# Altium project ATLAS(SAM9X75D).PrjPcb
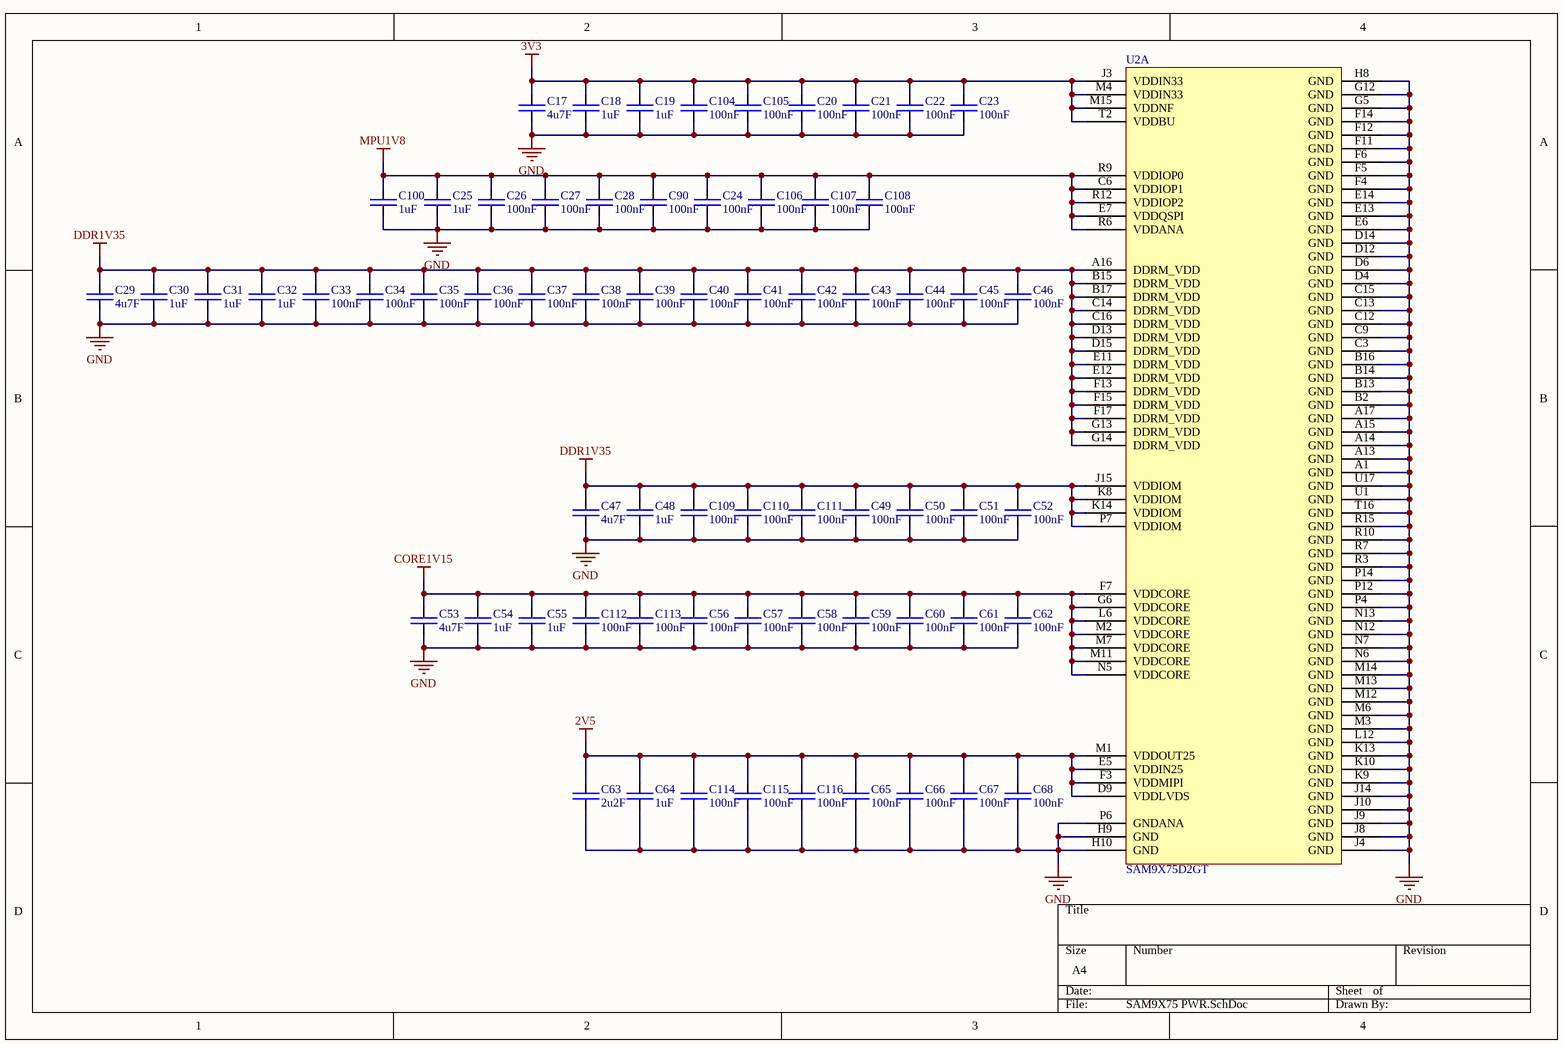
[diagram p0: SAM9X75 PWR.SchDoc]
10 sheets, 179 parts. Net scope: global (net labels, ports and power ports of the same name join across sheets).
Board file: PCB.PcbDoc
Sheets:
  SAM9X75 PWR.SchDoc
  SAM9X75 Pinout.SchDoc
  PMIC.SchDoc
  Ethernet.SchDoc
  SMARC Pinout-1.SchDoc
  SMARC Pinout-2.SchDoc
  SMARC Pinout-3.SchDoc
  Flash.SchDoc
  Level Shifting.SchDoc
  LDO.SchDoc

## Sheet SAM9X75 PWR.SchDoc
size A4; SheetNumber: 1; SheetTotal: 10

### Parts
C17  4u7F  [CAP-0805]
C18  1uF  [CAP-0805]
C19  1uF  [CAP-0805]
C20  100nF  [CAP-0201]
C21  100nF  [CAP-0201]
C22  100nF  [CAP-0201]
C23  100nF  [CAP-0201]
C24  100nF  [CAP-0201]
C25  1uF  [CAP-0805]
C26  100nF  [CAP-0201]
C27  100nF  [CAP-0201]
C28  100nF  [CAP-0201]
C29  4u7F  [CAP-0805]
C30  1uF  [CAP-0805]
C31  1uF  [CAP-0805]
C32  1uF  [CAP-0805]
C33  100nF  [CAP-0201]
C34  100nF  [CAP-0201]
C35  100nF  [CAP-0201]
C36  100nF  [CAP-0201]
C37  100nF  [CAP-0201]
C38  100nF  [CAP-0201]
C39  100nF  [CAP-0201]
C40  100nF  [CAP-0201]
C41  100nF  [CAP-0201]
C42  100nF  [CAP-0201]
C43  100nF  [CAP-0201]
C44  100nF  [CAP-0201]
C45  100nF  [CAP-0201]
C46  100nF  [CAP-0201]
C47  4u7F  [CAP-0805]
C48  1uF  [CAP-0805]
C49  100nF  [CAP-0201]
C50  100nF  [CAP-0201]
C51  100nF  [CAP-0201]
C52  100nF  [CAP-0201]
C53  4u7F  [CAP-0805]
C54  1uF  [CAP-0805]
C55  1uF  [CAP-0805]
C56  100nF  [CAP-0201]
C57  100nF  [CAP-0201]
C58  100nF  [CAP-0201]
C59  100nF  [CAP-0201]
C60  100nF  [CAP-0201]
C61  100nF  [CAP-0201]
C62  100nF  [CAP-0201]
C63  2u2F  [CAP-0805]
C64  1uF  [CAP-0805]
C65  100nF  [CAP-0201]
C66  100nF  [CAP-0201]
C67  100nF  [CAP-0201]
C68  100nF  [CAP-0201]
C90  100nF  [CAP-0201]
C100  1uF  [CAP-0805]
C104  100nF  [CAP-0201]
C105  100nF  [CAP-0201]
C106  100nF  [CAP-0201]
C107  100nF  [CAP-0201]
C108  100nF  [CAP-0201]
C109  100nF  [CAP-0201]
C110  100nF  [CAP-0201]
C111  100nF  [CAP-0201]
C112  100nF  [CAP-0201]
C113  100nF  [CAP-0201]
C114  100nF  [CAP-0201]
C115  100nF  [CAP-0201]
C116  100nF  [CAP-0201]
U2  SAM9X75D2GT  [SAM9X75D]  (part A of 4)

### Nets
2V5: C63.2 C64.2 C65.2 C66.2 C67.2 C68.2 C114.2 C115.2 C116.2 U2.D9(VDDLVDS) U2.E5(VDDIN25) U2.F3(VDDMIPI) U2.M1(VDDOUT25)
3V3: C17.2 C18.2 C19.2 C20.2 C21.2 C22.2 C23.2 C104.2 C105.2 U2.J3(VDDIN33) U2.M4(VDDIN33) U2.M15(VDDNF) U2.T2(VDDBU)
CORE1V15: C53.2 C54.2 C55.2 C56.2 C57.2 C58.2 C59.2 C60.2 C61.2 C62.2 C112.2 C113.2 U2.F7(VDDCORE) U2.G6(VDDCORE) U2.L6(VDDCORE) U2.M2(VDDCORE) U2.M7(VDDCORE) U2.M11(VDDCORE) U2.N5(VDDCORE)
DDR1V35: C29.2 C30.2 C31.2 C32.2 C33.2 C34.2 C35.2 C36.2 C37.2 C38.2 C39.2 C40.2 C41.2 C42.2 C43.2 C44.2 C45.2 C46.2 C47.2 C48.2 C49.2 C50.2 C51.2 C52.2 C109.2 C110.2 C111.2 U2.A16(DDRM_VDD) U2.B15(DDRM_VDD) U2.B17(DDRM_VDD) U2.C14(DDRM_VDD) U2.C16(DDRM_VDD) U2.D13(DDRM_VDD) U2.D15(DDRM_VDD) U2.E11(DDRM_VDD) U2.E12(DDRM_VDD) U2.F13(DDRM_VDD) U2.F15(DDRM_VDD) U2.F17(DDRM_VDD) U2.G13(DDRM_VDD) U2.G14(DDRM_VDD) U2.J15(VDDIOM) U2.K8(VDDIOM) U2.K14(VDDIOM) U2.P7(VDDIOM)
GND: C17.1 C18.1 C19.1 C20.1 C21.1 C22.1 C23.1 C24.1 C25.1 C26.1 C27.1 C28.1 C29.1 C30.1 C31.1 C32.1 C33.1 C34.1 C35.1 C36.1 C37.1 C38.1 C39.1 C40.1 C41.1 C42.1 C43.1 C44.1 C45.1 C46.1 C47.1 C48.1 C49.1 C50.1 C51.1 C52.1 C53.1 C54.1 C55.1 C56.1 C57.1 C58.1 C59.1 C60.1 C61.1 C62.1 C63.1 C64.1 C65.1 C66.1 C67.1 C68.1 C90.1 C100.1 C104.1 C105.1 C106.1 C107.1 C108.1 C109.1 C110.1 C111.1 C112.1 C113.1 C114.1 C115.1 C116.1 U2.A1(GND) U2.A13(GND) U2.A14(GND) U2.A15(GND) U2.A17(GND) U2.B2(GND) U2.B13(GND) U2.B14(GND) U2.B16(GND) U2.C3(GND) U2.C9(GND) U2.C12(GND) U2.C13(GND) U2.C15(GND) U2.D4(GND) U2.D6(GND) U2.D12(GND) U2.D14(GND) U2.E6(GND) U2.E13(GND) U2.E14(GND) U2.F4(GND) U2.F5(GND) U2.F6(GND) U2.F11(GND) U2.F12(GND) U2.F14(GND) U2.G5(GND) U2.G12(GND) U2.H8(GND) U2.H9(GND) U2.H10(GND) U2.J4(GND) U2.J8(GND) U2.J9(GND) U2.J10(GND) U2.J14(GND) U2.K9(GND) U2.K10(GND) U2.K13(GND) U2.L12(GND) U2.M3(GND) U2.M6(GND) U2.M12(GND) U2.M13(GND) U2.M14(GND) U2.N6(GND) U2.N7(GND) U2.N12(GND) U2.N13(GND) U2.P4(GND) U2.P6(GNDANA) U2.P12(GND) U2.P14(GND) U2.R3(GND) U2.R7(GND) U2.R10(GND) U2.R15(GND) U2.T16(GND) U2.U1(GND) U2.U17(GND)
MPU1V8: C24.2 C25.2 C26.2 C27.2 C28.2 C90.2 C100.2 C106.2 C107.2 C108.2 U2.C6(VDDIOP1) U2.E7(VDDQSPI) U2.R6(VDDANA) U2.R9(VDDIOP0) U2.R12(VDDIOP2)

### Library data of the parts
C17-C19 C25 C29-C32 C47 C48 C53-C55 C63 C64 C100 = CAP-0805: Capacitor chip unpolarized. 0805
C20-C24 C26-C28 C33-C46 C49-C52 C56-C62 C65-C68 C90 C104-C116 = CAP-0201: Capacitor chip upolarized. 0201
U2 = SAM9X75D2GT: ARM9 SiP 2GBit Internal DDR3L

## Sheet SAM9X75 Pinout.SchDoc
size A4; SheetNumber: 2; SheetTotal: 10
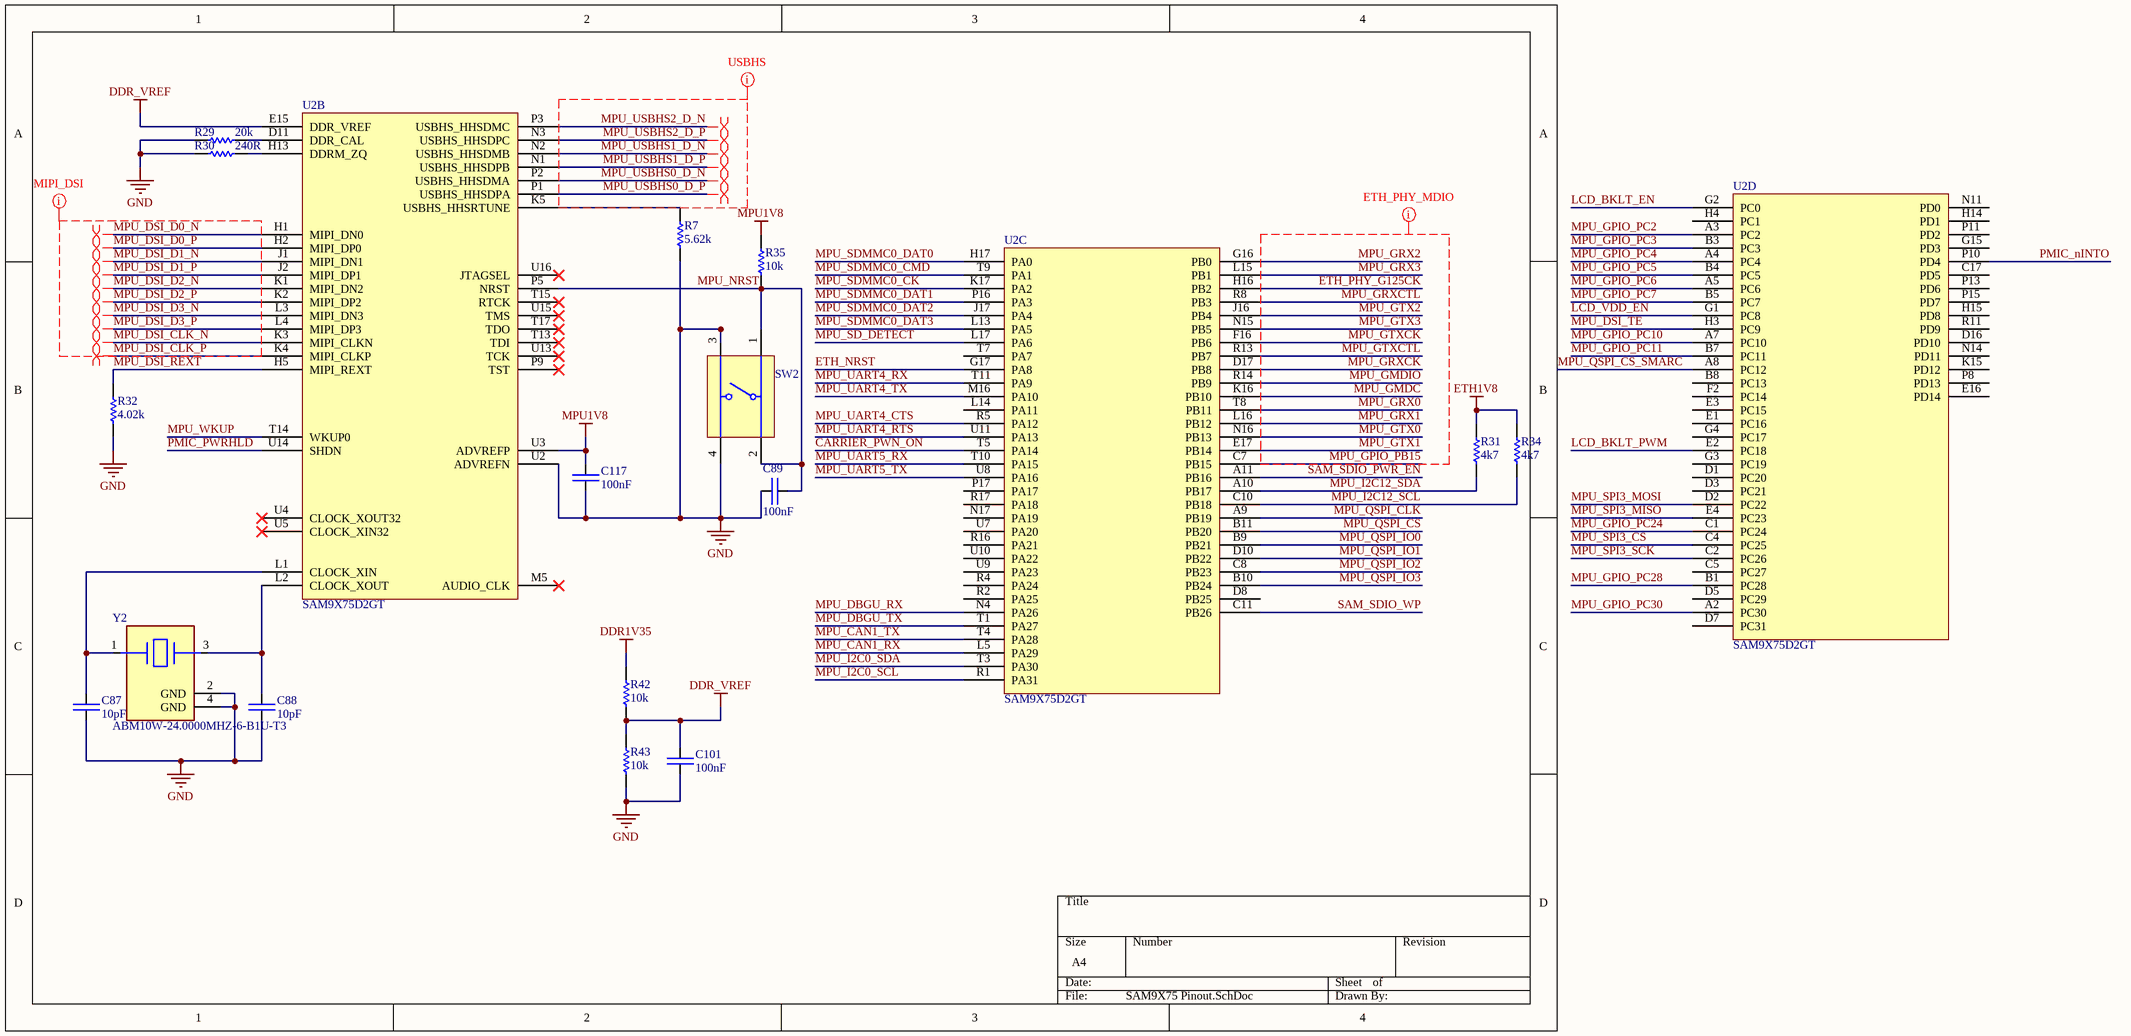
[diagram p1: SAM9X75 Pinout.SchDoc]

### Parts
C87  10pF  [CAP-0603]
C88  10pF  [CAP-0603]
C89  100nF  [CAP-0603]
C101  100nF  [CAP-0201]
C117  100nF  [CAP-0201]
R7  5.62k  [RES-0201]
R29  20k  [RES-0201]
R30  240R  [RES-0201]
R31  4k7  [RES-0201]
R32  4.02k  [RES-0201]
R34  4k7  [RES-0201]
R35  10k  [RES-0603]
R42  10k  [RES-0201]
R43  10k  [RES-0201]
SW2  FSM4JSMATR  [TECO-FSM4JSMATR_V]  (value not drawn)
U2  SAM9X75D2GT  [SAM9X75D]  (parts B,C,D of 4)
Y2  ABM10W-24.0000MHZ-6-B1U-T3  [FP-ABM10W-MFG]

### Nets
DDR1V35: R42.2
DDR_VREF: C101.2 R42.1 R43.2 U2.E15(DDR_VREF)
ETH1V8: R31.2 R34.2
GND: C87.1 C88.1 C89.2 C101.1 C117.1 R7.1 R29.1 R30.1 R32.1 R43.1 SW2.3 SW2.4 U2.U2(ADVREFN) Y2.2(GND) Y2.4(GND)
MPU1V8: C117.2 R35.2 U2.U3(ADVREFP)
CARRIER_PWN_ON: U2.T5(PA14)
ETH_NRST: U2.G17(PA8)
ETH_PHY_G125CK: U2.H16(PB2)
LCD_BKLT_EN: U2.G2(PC0)
LCD_BKLT_PWM: U2.E2(PC18)
LCD_VDD_EN: U2.G1(PC8)
MPU_CAN1_RX: U2.L5(PA29)
MPU_CAN1_TX: U2.T4(PA28)
MPU_DBGU_RX: U2.N4(PA26)
MPU_DBGU_TX: U2.T1(PA27)
MPU_DSI_CLK_N: U2.K3(MIPI_CLKN)
MPU_DSI_CLK_P: U2.K4(MIPI_CLKP)
MPU_DSI_D0_N: U2.H1(MIPI_DN0)
MPU_DSI_D0_P: U2.H2(MIPI_DP0)
MPU_DSI_D1_N: U2.J1(MIPI_DN1)
MPU_DSI_D1_P: U2.J2(MIPI_DP1)
MPU_DSI_D2_N: U2.K1(MIPI_DN2)
MPU_DSI_D2_P: U2.K2(MIPI_DP2)
MPU_DSI_D3_N: U2.L3(MIPI_DN3)
MPU_DSI_D3_P: U2.L4(MIPI_DP3)
MPU_DSI_REXT: R32.2 U2.H5(MIPI_REXT)
MPU_DSI_TE: U2.H3(PC9)
MPU_GMDC: U2.K16(PB10)
MPU_GMDIO: U2.R14(PB9)
MPU_GPIO_PB15: U2.C7(PB15)
MPU_GPIO_PC2: U2.A3(PC2)
MPU_GPIO_PC3: U2.B3(PC3)
MPU_GPIO_PC4: U2.A4(PC4)
MPU_GPIO_PC5: U2.B4(PC5)
MPU_GPIO_PC6: U2.A5(PC6)
MPU_GPIO_PC7: U2.B5(PC7)
MPU_GPIO_PC10: U2.A7(PC10)
MPU_GPIO_PC11: U2.B7(PC11)
MPU_GPIO_PC24: U2.C1(PC24)
MPU_GPIO_PC28: U2.B1(PC28)
MPU_GPIO_PC30: U2.A2(PC30)
MPU_GRX0: U2.T8(PB11)
MPU_GRX1: U2.L16(PB12)
MPU_GRX2: U2.G16(PB0)
MPU_GRX3: U2.L15(PB1)
MPU_GRXCK: U2.D17(PB8)
MPU_GRXCTL: U2.R8(PB3)
MPU_GTX0: U2.N16(PB13)
MPU_GTX1: U2.E17(PB14)
MPU_GTX2: U2.J16(PB4)
MPU_GTX3: U2.N15(PB5)
MPU_GTXCK: U2.F16(PB6)
MPU_GTXCTL: U2.R13(PB7)
MPU_I2C0_SCL: U2.R1(PA31)
MPU_I2C0_SDA: U2.T3(PA30)
MPU_I2C12_SCL: R34.1 U2.C10(PB18)
MPU_I2C12_SDA: R31.1 U2.A10(PB17)
MPU_NRST: C89.1 R35.1 SW2.1 SW2.2 U2.P5(NRST)
MPU_QSPI_CLK: U2.A9(PB19)
MPU_QSPI_CS: U2.B11(PB20)
MPU_QSPI_CS_SMARC: U2.A8(PC12)
MPU_QSPI_IO0: U2.B9(PB21)
MPU_QSPI_IO1: U2.D10(PB22)
MPU_QSPI_IO2: U2.C8(PB23)
MPU_QSPI_IO3: U2.B10(PB24)
MPU_SD_DETECT: U2.L17(PA6)
MPU_SDMMC0_CK: U2.K17(PA2)
MPU_SDMMC0_CMD: U2.T9(PA1)
MPU_SDMMC0_DAT0: U2.H17(PA0)
MPU_SDMMC0_DAT1: U2.P16(PA3)
MPU_SDMMC0_DAT2: U2.J17(PA4)
MPU_SDMMC0_DAT3: U2.L13(PA5)
MPU_SPI3_CS: U2.C4(PC25)
MPU_SPI3_MISO: U2.E4(PC23)
MPU_SPI3_MOSI: U2.D2(PC22)
MPU_SPI3_SCK: U2.C2(PC26)
MPU_UART4_CTS: U2.R5(PA12)
MPU_UART4_RTS: U2.U11(PA13)
MPU_UART4_RX: U2.T11(PA9)
MPU_UART4_TX: U2.M16(PA10)
MPU_UART5_RX: U2.T10(PA15)
MPU_UART5_TX: U2.U8(PA16)
MPU_USBHS0_D_N: U2.P2(USBHS_HHSDMA)
MPU_USBHS0_D_P: U2.P1(USBHS_HHSDPA)
MPU_USBHS1_D_N: U2.N2(USBHS_HHSDMB)
MPU_USBHS1_D_P: U2.N1(USBHS_HHSDPB)
MPU_USBHS2_D_N: U2.P3(USBHS_HHSDMC)
MPU_USBHS2_D_P: U2.N3(USBHS_HHSDPC)
MPU_WKUP: U2.T14(WKUP0)
PMIC_nINTO: U2.P10(PD4)
PMIC_PWRHLD: U2.U14(SHDN)
SAM_SDIO_PWR_EN: U2.A11(PB16)
SAM_SDIO_WP: U2.C11(PB26)
NetC87_2: C87.2 U2.L1(CLOCK_XIN) Y2.1
NetC88_2: C88.2 U2.L2(CLOCK_XOUT) Y2.3
NetR7_2: R7.2 U2.K5(USBHS_HHSRTUNE)
NetR29_2: R29.2 U2.D11(DDR_CAL)
NetR30_2: R30.2 U2.H13(DDRM_ZQ)

Not connected (* = marked no-connect by the designer): U2 B8(PC13) C5(PC27) C17(PD5) D1(PC20) D3(PC21) D5(PC29) D7(PC31) D8(PB25) D16(PD10) E1(PC16) E3(PC15) E16(PD14) F2(PC14) G3(PC19) G4(PC17) G15(PD3) H4(PC1) H14(PD1) H15(PD8) K15(PD12) L14(PA11) M5(AUDIO_CLK)* N11(PD0) N14(PD11) N17(PA19) P8(PD13) P9(TST)* P11(PD2) P13(PD6) P15(PD7) P17(PA17) R2(PA25) R4(PA24) R11(PD9) R16(PA21) R17(PA18) T7(PA7) T13(TDI)* T15(RTCK)* T17(TDO)* U4(CLOCK_XOUT32)* U5(CLOCK_XIN32)* U7(PA20) U9(PA23) U10(PA22) U13(TCK)* U15(TMS)* U16(JTAGSEL)*

### Layout directives
differential pair: MPU_DSI_CLK_N, MPU_DSI_CLK_P, MPU_DSI_D0_N, MPU_DSI_D0_P, MPU_DSI_D1_N, MPU_DSI_D1_P, MPU_DSI_D2_N, MPU_DSI_D2_P, MPU_DSI_D3_N, MPU_DSI_D3_P, MPU_USBHS0_D_N, MPU_USBHS0_D_P, MPU_USBHS1_D_N, MPU_USBHS1_D_P, MPU_USBHS2_D_N, MPU_USBHS2_D_P
net class MIPI_DSI_PAIRS: MPU_DSI_CLK_N, MPU_DSI_CLK_P, MPU_DSI_D0_N, MPU_DSI_D0_P, MPU_DSI_D1_N, MPU_DSI_D1_P, MPU_DSI_D2_N, MPU_DSI_D2_P, MPU_DSI_D3_N, MPU_DSI_D3_P
net class ETH_PHY_MDIO: ETH_PHY_G125CK, MPU_GMDC, MPU_GMDIO, MPU_GPIO_PB15, MPU_GRX0, MPU_GRX1, MPU_GRX2, MPU_GRX3, MPU_GRXCK, MPU_GRXCTL, MPU_GTX0, MPU_GTX1, MPU_GTX2, MPU_GTX3, MPU_GTXCK, MPU_GTXCTL
net class USBHS: MPU_USBHS0_D_N, MPU_USBHS0_D_P, MPU_USBHS1_D_N, MPU_USBHS1_D_P, MPU_USBHS2_D_N, MPU_USBHS2_D_P

### Library data of the parts
C87-C89 = CAP-0603: Capacitor chip unpolarized. 0603
C101 C117 = CAP-0201: Capacitor chip upolarized. 0201
R7 R29-R32 R34 R42 R43 = RES-0201: Resistor chip. 0201
R35 = RES-0603: Resistor chip. 0603
SW2 = CMP-2000-07486-1: Micro Miniature Push Button Switch FSM JSM, 50 mA, -35 to 85 degC, 4-Pin SMD, RoHS, Tape and Reel; Manufacturer: TE Connectivity; Mechanical Life: 100000Cycles; Current Rating: 50mA; Actuator Material: Polyamide; Max Voltage Rating (DC): 12V; Capacitance: 0f; Illumination Type: Illuminated; Voltage Rating (DC): 24V; Case\/Package: SMD/SMT; Operating Force: 160gf; Contact Resistance: 100mOhm; Actuator Length: 0.055inch; Switch Travel: 0.25mm; Throw Configuration: SPST; Termination: GullWing; Contact Plating: Silver; Orientation: Straight; Mounting Technology: SurfaceMount; REACH SVHC: Unknown; Electrical Life: 100000Cycles; Package Reference: FSM4JSMATR; Max Operating Temperature: 85degC; Manufacturer URL: http://www.te.com/; Package Description: 4-Pin Surface Mount Device, Body 6 x 6 mm, Pitch 4.5 mm; Datasheet Version: Rev. V, 02/2015; Packaging: TapeandReel; Min Operating Temperature: -35degC; Mount: SurfaceMount; Contact Current Rating: 50mA; Contact Material: CopperAlloy; Package Quantity: 1200; Datasheet URL: http://www.te.com/commerce/DocumentDelivery/DDEController?Action=showdoc&DocId=Customer+Drawing%7F2-1437565-7%7FV%7Fpdf%7FEnglish%7FENG_CD_2-1437565-7_V.pdf%7F4-1437565-2; RoHSCompliant: true
U2 = SAM9X75D2GT: ARM9 SiP 2GBit Internal DDR3L
Y2 = CMP-27762-005164-1: Crystal 24MHz ±10ppm 6pF SMD-4 2.5mm x 2mm

## Sheet PMIC.SchDoc
size A4; SheetNumber: 3; SheetTotal: 10
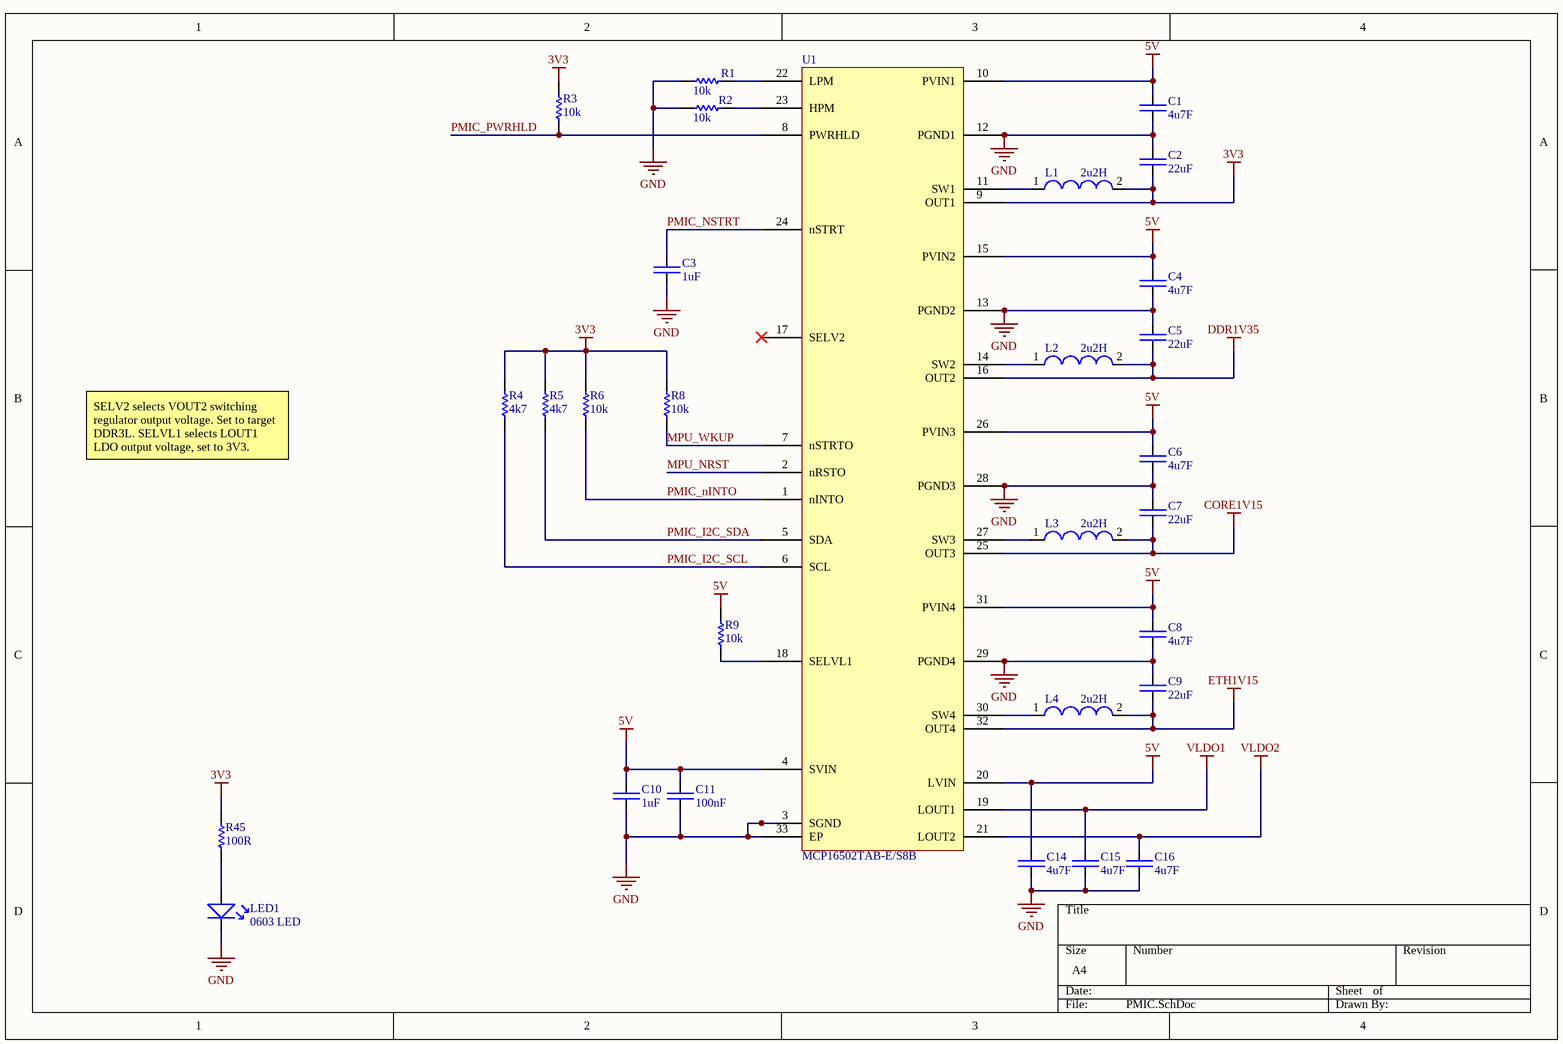
[diagram p2: PMIC.SchDoc]

### Parts
C1  4u7F  [CAP-0805]
C2  22uF  [CAP-1206]
C3  1uF  [CAP-0805]
C4  4u7F  [CAP-0805]
C5  22uF  [CAP-1206]
C6  4u7F  [CAP-0805]
C7  22uF  [CAP-1206]
C8  4u7F  [CAP-0805]
C9  22uF  [CAP-1206]
C10  1uF  [CAP-0805]
C11  100nF  [CAP-0603]
C14  4u7F  [CAP-0805]
C15  4u7F  [CAP-0805]
C16  4u7F  [CAP-0805]
L1  2u2H  [IND-1210]
L2  2u2H  [IND-1210]
L3  2u2H  [IND-1210]
L4  2u2H  [IND-1210]
LED1  0603 LED  [0603 LED]
R1  10k  [RES-0603]
R2  10k  [RES-0603]
R3  10k  [RES-0603]
R4  4k7  [RES-0603]
R5  4k7  [RES-0603]
R6  10k  [RES-0603]
R8  10k  [RES-0603]
R9  10k  [RES-0603]
R45  100R  [RES-0603]
U1  MCP16502TAB-E/S8B  [MCP16502TAB-E/S8B]

### Nets
3V3: C2.1 L1.2 R3.1 R4.2 R5.2 R6.2 R8.2 R45.2 U1.9(OUT1)
5V: C1.2 C4.2 C6.2 C8.2 C10.2 C11.2 C14.2 R9.2 U1.4(SVIN) U1.10(PVIN1) U1.15(PVIN2) U1.20(LVIN) U1.26(PVIN3) U1.31(PVIN4)
CORE1V15: C7.1 L3.2 U1.25(OUT3)
DDR1V35: C5.1 L2.2 U1.16(OUT2)
ETH1V15: C9.1 L4.2 U1.32(OUT4)
GND: C1.1 C2.2 C3.1 C4.1 C5.2 C6.1 C7.2 C8.1 C9.2 C10.1 C11.1 C14.1 C15.1 C16.1 LED1.2 R1.2 R2.2 U1.3(SGND) U1.12(PGND1) U1.13(PGND2) U1.28(PGND3) U1.29(PGND4) U1.33(EP)
VLDO1: C15.2 U1.19(LOUT1)
VLDO2: C16.2 U1.21(LOUT2)
MPU_NRST: U1.2(nRSTO)
MPU_WKUP: R8.1 U1.7(nSTRTO)
PMIC_I2C_SCL: R4.1 U1.6(SCL)
PMIC_I2C_SDA: R5.1 U1.5(SDA)
PMIC_nINTO: R6.1 U1.1(nINTO)
PMIC_NSTRT: C3.2 U1.24(nSTRT)
PMIC_PWRHLD: R3.2 U1.8(PWRHLD)
NetL1_1: L1.1 U1.11(SW1)
NetL2_1: L2.1 U1.14(SW2)
NetL3_1: L3.1 U1.27(SW3)
NetL4_1: L4.1 U1.30(SW4)
NetLED1_1: LED1.1 R45.1
NetR1_1: R1.1 U1.22(LPM)
NetR2_1: R2.1 U1.23(HPM)
NetR9_1: R9.1 U1.18(SELVL1)

Not connected (* = marked no-connect by the designer): U1 17(SELV2)*

### Notes on the sheet
- SELV2 selects VOUT2 switching regulator output voltage. Set to target DDR3L. SELVL1 selects LOUT1 LDO output voltage, set to 3V3.

### Library data of the parts
C1 C3 C4 C6 C8 C10 C14-C16 = CAP-0805: Capacitor chip unpolarized. 0805
C2 C5 C7 C9 = CAP-1206: Capacitor chip unpolarized. 1206
C11 = CAP-0603: Capacitor chip unpolarized. 0603
L1-L4 = IND-1210
R1-R6 R8 R9 R45 = RES-0603: Resistor chip. 0603
U1 = MCP16502TAB-E/S8B: Microchip PMIC for SAM9X devices

## Sheet Ethernet.SchDoc
size A4; SheetNumber: 4; SheetTotal: 10
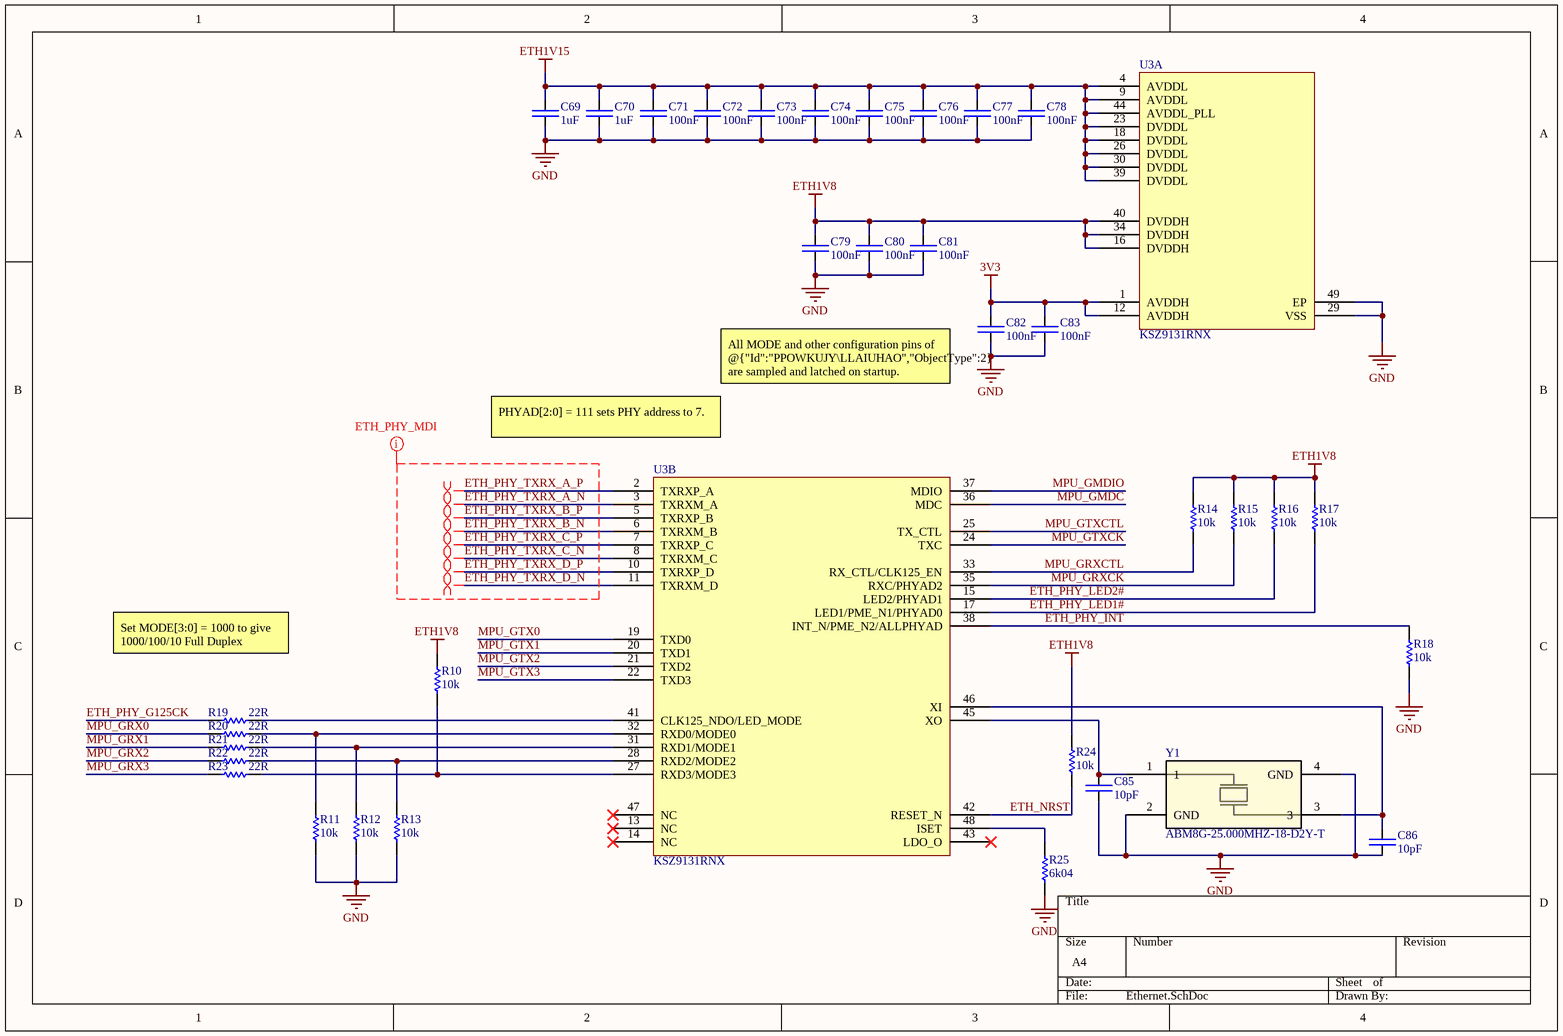
[diagram p3: Ethernet.SchDoc]

### Parts
C69  1uF  [CAP-0805]
C70  1uF  [CAP-0805]
C71  100nF  [CAP-0603]
C72  100nF  [CAP-0603]
C73  100nF  [CAP-0603]
C74  100nF  [CAP-0603]
C75  100nF  [CAP-0603]
C76  100nF  [CAP-0603]
C77  100nF  [CAP-0603]
C78  100nF  [CAP-0603]
C79  100nF  [CAP-0603]
C80  100nF  [CAP-0603]
C81  100nF  [CAP-0603]
C82  100nF  [CAP-0603]
C83  100nF  [CAP-0603]
C85  10pF  [CAP-0603]
C86  10pF  [CAP-0603]
R10  10k  [RES-0603]
R11  10k  [RES-0603]
R12  10k  [RES-0603]
R13  10k  [RES-0603]
R14  10k  [RES-0603]
R15  10k  [RES-0603]
R16  10k  [RES-0603]
R17  10k  [RES-0603]
R18  10k  [RES-0603]
R19  22R  [RES-0603]
R20  22R  [RES-0603]
R21  22R  [RES-0603]
R22  22R  [RES-0603]
R23  22R  [RES-0603]
R24  10k  [RES-0603]
R25  6k04  [RES-0603]
U3  KSZ9131RNX  [KSZ9131RNXC-TR]  (parts A,B of 2)
Y1  ABM8G-25.000MHZ-18-D2Y-T  [CRYSTAL_ABM8G_ABR]

### Nets
3V3: C82.2 C83.2 U3.1(AVDDH) U3.12(AVDDH)
ETH1V8: C79.2 C80.2 C81.2 R10.2 R14.2 R15.2 R16.2 R17.2 R24.2 U3.16(DVDDH) U3.34(DVDDH) U3.40(DVDDH)
ETH1V15: C69.2 C70.2 C71.2 C72.2 C73.2 C74.2 C75.2 C76.2 C77.2 C78.2 U3.4(AVDDL) U3.9(AVDDL) U3.18(DVDDL) U3.23(DVDDL) U3.26(DVDDL) U3.30(DVDDL) U3.39(DVDDL) U3.44(AVDDL_PLL)
GND: C69.1 C70.1 C71.1 C72.1 C73.1 C74.1 C75.1 C76.1 C77.1 C78.1 C79.1 C80.1 C81.1 C82.1 C83.1 C85.1 C86.1 R11.1 R12.1 R13.1 R18.1 R25.1 U3.29(VSS) U3.49(EP) Y1.2(GND) Y1.4(GND)
ETH_NRST: R24.1 U3.42(RESET_N)
ETH_PHY_G125CK: R19.2
ETH_PHY_INT: R18.2 U3.38(INT_N/PME_N2/ALLPHYAD)
ETH_PHY_LED1#: R17.1 U3.17(LED1/PME_N1/PHYAD0)
ETH_PHY_LED2#: R16.1 U3.15(LED2/PHYAD1)
ETH_PHY_TXRX_A_N: U3.3(TXRXM_A)
ETH_PHY_TXRX_A_P: U3.2(TXRXP_A)
ETH_PHY_TXRX_B_N: U3.6(TXRXM_B)
ETH_PHY_TXRX_B_P: U3.5(TXRXP_B)
ETH_PHY_TXRX_C_N: U3.8(TXRXM_C)
ETH_PHY_TXRX_C_P: U3.7(TXRXP_C)
ETH_PHY_TXRX_D_N: U3.11(TXRXM_D)
ETH_PHY_TXRX_D_P: U3.10(TXRXP_D)
MPU_GMDC: U3.36(MDC)
MPU_GMDIO: U3.37(MDIO)
MPU_GRX0: R20.2
MPU_GRX1: R21.2
MPU_GRX2: R22.2
MPU_GRX3: R23.2
MPU_GRXCK: R15.1 U3.35(RXC/PHYAD2)
MPU_GRXCTL: R14.1 U3.33(RX_CTL/CLK125_EN)
MPU_GTX0: U3.19(TXD0)
MPU_GTX1: U3.20(TXD1)
MPU_GTX2: U3.21(TXD2)
MPU_GTX3: U3.22(TXD3)
MPU_GTXCK: U3.24(TXC)
MPU_GTXCTL: U3.25(TX_CTL)
NetC85_2: C85.2 U3.45(XO) Y1.1
NetC86_2: C86.2 U3.46(XI) Y1.3
NetR10_1: R10.1 R23.1 U3.27(RXD3/MODE3)
NetR11_2: R11.2 R20.1 U3.32(RXD0/MODE0)
NetR12_2: R12.2 R21.1 U3.31(RXD1/MODE1)
NetR13_2: R13.2 R22.1 U3.28(RXD2/MODE2)
NetR19_1: R19.1 U3.41(CLK125_NDO/LED_MODE)
NetR25_2: R25.2 U3.48(ISET)

Not connected (* = marked no-connect by the designer): U3 13(NC)* 14(NC)* 43(LDO_O)* 47(NC)*

### Layout directives
differential pair: ETH_PHY_TXRX_A_N, ETH_PHY_TXRX_A_P, ETH_PHY_TXRX_B_N, ETH_PHY_TXRX_B_P, ETH_PHY_TXRX_C_N, ETH_PHY_TXRX_C_P, ETH_PHY_TXRX_D_N, ETH_PHY_TXRX_D_P
net class ETH_PHY_MDI_PAIRS: ETH_PHY_TXRX_A_N, ETH_PHY_TXRX_A_P, ETH_PHY_TXRX_B_N, ETH_PHY_TXRX_B_P, ETH_PHY_TXRX_C_N, ETH_PHY_TXRX_C_P, ETH_PHY_TXRX_D_N, ETH_PHY_TXRX_D_P

### Notes on the sheet
- (near C82) All MODE and other configuration pins of @{"Id":"PPOWKUJY\LLAIUHAO","ObjectType":2} are sampled and latched on startup.
- PHYAD[2:0] = 111 sets PHY address to 7.
- Set MODE[3:0] = 1000 to give 1000/100/10 Full Duplex

### Library data of the parts
C69 C70 = CAP-0805: Capacitor chip unpolarized. 0805
C71-C83 C85 C86 = CAP-0603: Capacitor chip unpolarized. 0603
R10-R25 = RES-0603: Resistor chip. 0603
U3 = KSZ9131RNX: Eth PHY Gigabit
Y1 = ABM8G-25.000MHZ-18-D2Y-T: Description; Manufacturer_Name: Abracon; Copyright: Copyright (C) 2026 Ultra Librarian. All rights reserved.; Manufacturer_Part_Number: ABM8G-25.000MHZ-18-D2Y-T; RefDes: RefDes; Type: Type

## Sheet SMARC Pinout-1.SchDoc
size A4; SheetNumber: 5; SheetTotal: 10
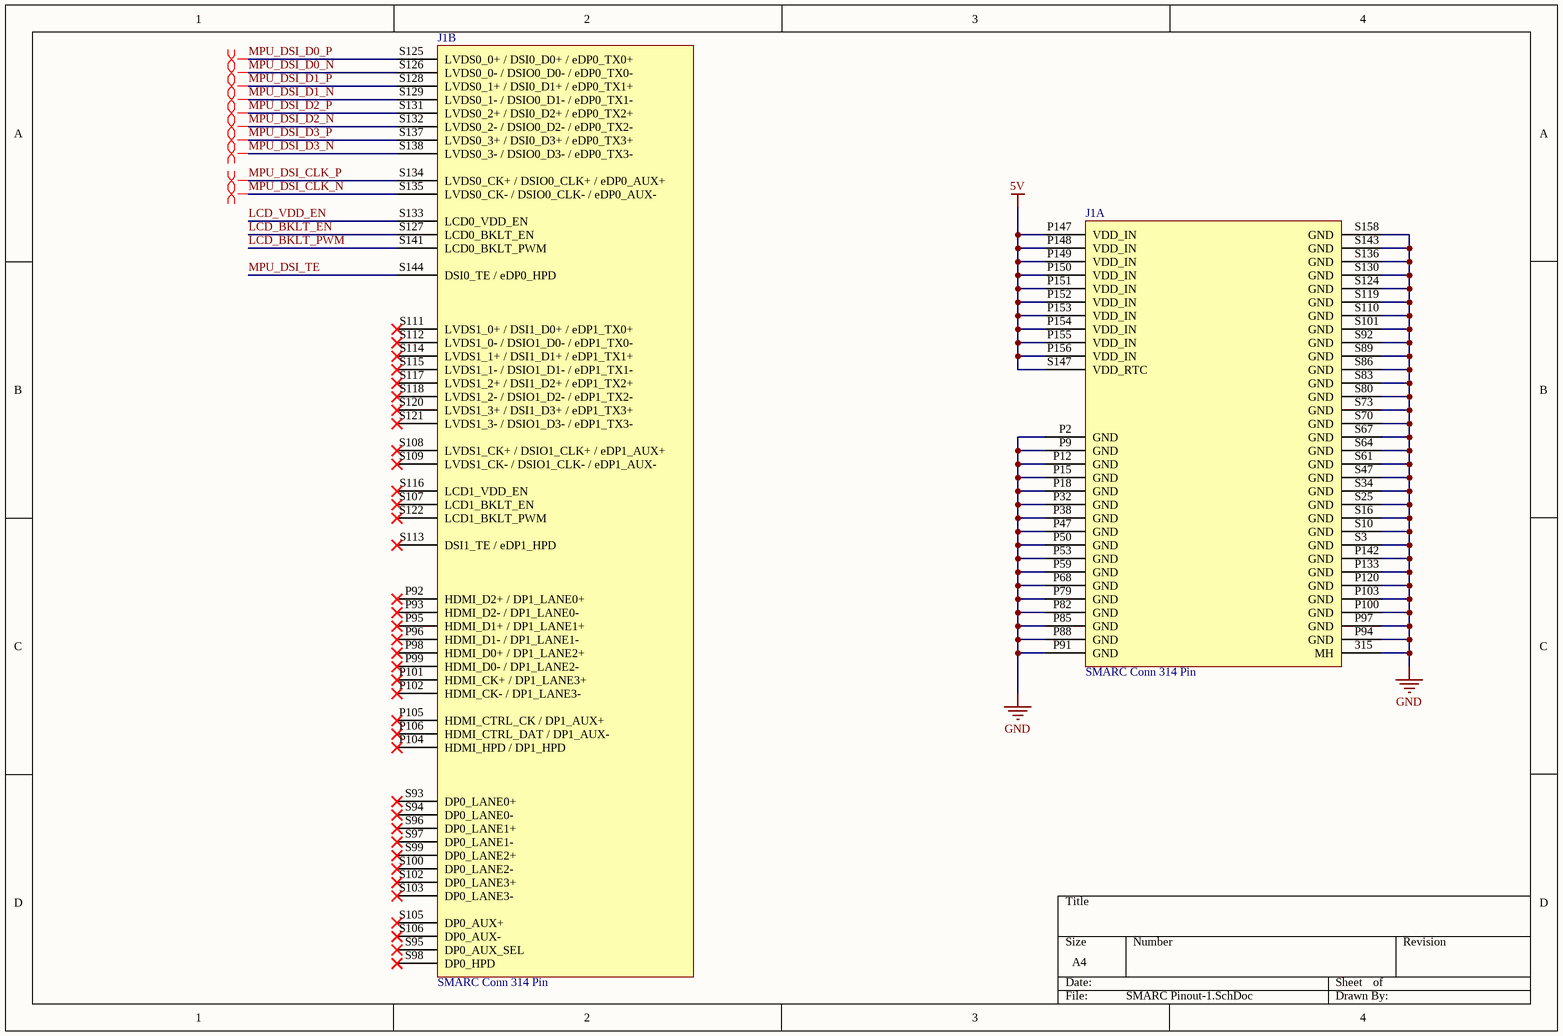
[diagram p4: SMARC Pinout-1.SchDoc]

### Parts
J1  SMARC Conn 314 Pin  [SMARC Conn 314 Pin]  (parts A,B of 6)

### Nets
5V: J1.P147(VDD_IN) J1.P148(VDD_IN) J1.P149(VDD_IN) J1.P150(VDD_IN) J1.P151(VDD_IN) J1.P152(VDD_IN) J1.P153(VDD_IN) J1.P154(VDD_IN) J1.P155(VDD_IN) J1.P156(VDD_IN) J1.S147(VDD_RTC)
GND: J1.315(MH) J1.P2(GND) J1.P9(GND) J1.P12(GND) J1.P15(GND) J1.P18(GND) J1.P32(GND) J1.P38(GND) J1.P47(GND) J1.P50(GND) J1.P53(GND) J1.P59(GND) J1.P68(GND) J1.P79(GND) J1.P82(GND) J1.P85(GND) J1.P88(GND) J1.P91(GND) J1.P94(GND) J1.P97(GND) J1.P100(GND) J1.P103(GND) J1.P120(GND) J1.P133(GND) J1.P142(GND) J1.S3(GND) J1.S10(GND) J1.S16(GND) J1.S25(GND) J1.S34(GND) J1.S47(GND) J1.S61(GND) J1.S64(GND) J1.S67(GND) J1.S70(GND) J1.S73(GND) J1.S80(GND) J1.S83(GND) J1.S86(GND) J1.S89(GND) J1.S92(GND) J1.S101(GND) J1.S110(GND) J1.S119(GND) J1.S124(GND) J1.S130(GND) J1.S136(GND) J1.S143(GND) J1.S158(GND)
LCD_BKLT_EN: J1.S127(LCD0_BKLT_EN)
LCD_BKLT_PWM: J1.S141(LCD0_BKLT_PWM)
LCD_VDD_EN: J1.S133(LCD0_VDD_EN)
MPU_DSI_CLK_N: J1.S135(LVDS0_CK-_/_DSIO0_CLK-_/_eDP0_AUX-)
MPU_DSI_CLK_P: J1.S134(LVDS0_CK+_/_DSIO0_CLK+_/_eDP0_AUX+)
MPU_DSI_D0_N: J1.S126(LVDS0_0-_/_DSIO0_D0-_/_eDP0_TX0-)
MPU_DSI_D0_P: J1.S125(LVDS0_0+_/_DSI0_D0+_/_eDP0_TX0+)
MPU_DSI_D1_N: J1.S129(LVDS0_1-_/_DSIO0_D1-_/_eDP0_TX1-)
MPU_DSI_D1_P: J1.S128(LVDS0_1+_/_DSI0_D1+_/_eDP0_TX1+)
MPU_DSI_D2_N: J1.S132(LVDS0_2-_/_DSIO0_D2-_/_eDP0_TX2-)
MPU_DSI_D2_P: J1.S131(LVDS0_2+_/_DSI0_D2+_/_eDP0_TX2+)
MPU_DSI_D3_N: J1.S138(LVDS0_3-_/_DSIO0_D3-_/_eDP0_TX3-)
MPU_DSI_D3_P: J1.S137(LVDS0_3+_/_DSI0_D3+_/_eDP0_TX3+)
MPU_DSI_TE: J1.S144(DSI0_TE_/_eDP0_HPD)

Not connected (* = marked no-connect by the designer): J1 P92(HDMI_D2+_/_DP1_LANE0+)* P93(HDMI_D2-_/_DP1_LANE0-)* P95(HDMI_D1+_/_DP1_LANE1+)* P96(HDMI_D1-_/_DP1_LANE1-)* P98(HDMI_D0+_/_DP1_LANE2+)* P99(HDMI_D0-_/_DP1_LANE2-)* P101(HDMI_CK+_/_DP1_LANE3+)* P102(HDMI_CK-_/_DP1_LANE3-)* P104(HDMI_HPD_/_DP1_HPD)* P105(HDMI_CTRL_CK_/_DP1_AUX+)* P106(HDMI_CTRL_DAT_/_DP1_AUX-)* S93(DP0_LANE0+)* S94(DP0_LANE0-)* S95(DP0_AUX_SEL)* S96(DP0_LANE1+)* S97(DP0_LANE1-)* S98(DP0_HPD)* S99(DP0_LANE2+)* S100(DP0_LANE2-)* S102(DP0_LANE3+)* S103(DP0_LANE3-)* S105(DP0_AUX+)* S106(DP0_AUX-)* S107(LCD1_BKLT_EN)* S108(LVDS1_CK+_/_DSIO1_CLK+_/_eDP1_AUX+)* S109(LVDS1_CK-_/_DSIO1_CLK-_/_eDP1_AUX-)* S111(LVDS1_0+_/_DSI1_D0+_/_eDP1_TX0+)* S112(LVDS1_0-_/_DSIO1_D0-_/_eDP1_TX0-)* S113(DSI1_TE_/_eDP1_HPD)* S114(LVDS1_1+_/_DSI1_D1+_/_eDP1_TX1+)* S115(LVDS1_1-_/_DSIO1_D1-_/_eDP1_TX1-)* S116(LCD1_VDD_EN)* S117(LVDS1_2+_/_DSI1_D2+_/_eDP1_TX2+)* S118(LVDS1_2-_/_DSIO1_D2-_/_eDP1_TX2-)* S120(LVDS1_3+_/_DSI1_D3+_/_eDP1_TX3+)* S121(LVDS1_3-_/_DSIO1_D3-_/_eDP1_TX3-)* S122(LCD1_BKLT_PWM)*

### Layout directives
differential pair: MPU_DSI_CLK_N, MPU_DSI_CLK_P, MPU_DSI_D0_N, MPU_DSI_D0_P, MPU_DSI_D1_N, MPU_DSI_D1_P, MPU_DSI_D2_N, MPU_DSI_D2_P, MPU_DSI_D3_N, MPU_DSI_D3_P

## Sheet SMARC Pinout-2.SchDoc
size A4; SheetNumber: 6; SheetTotal: 10
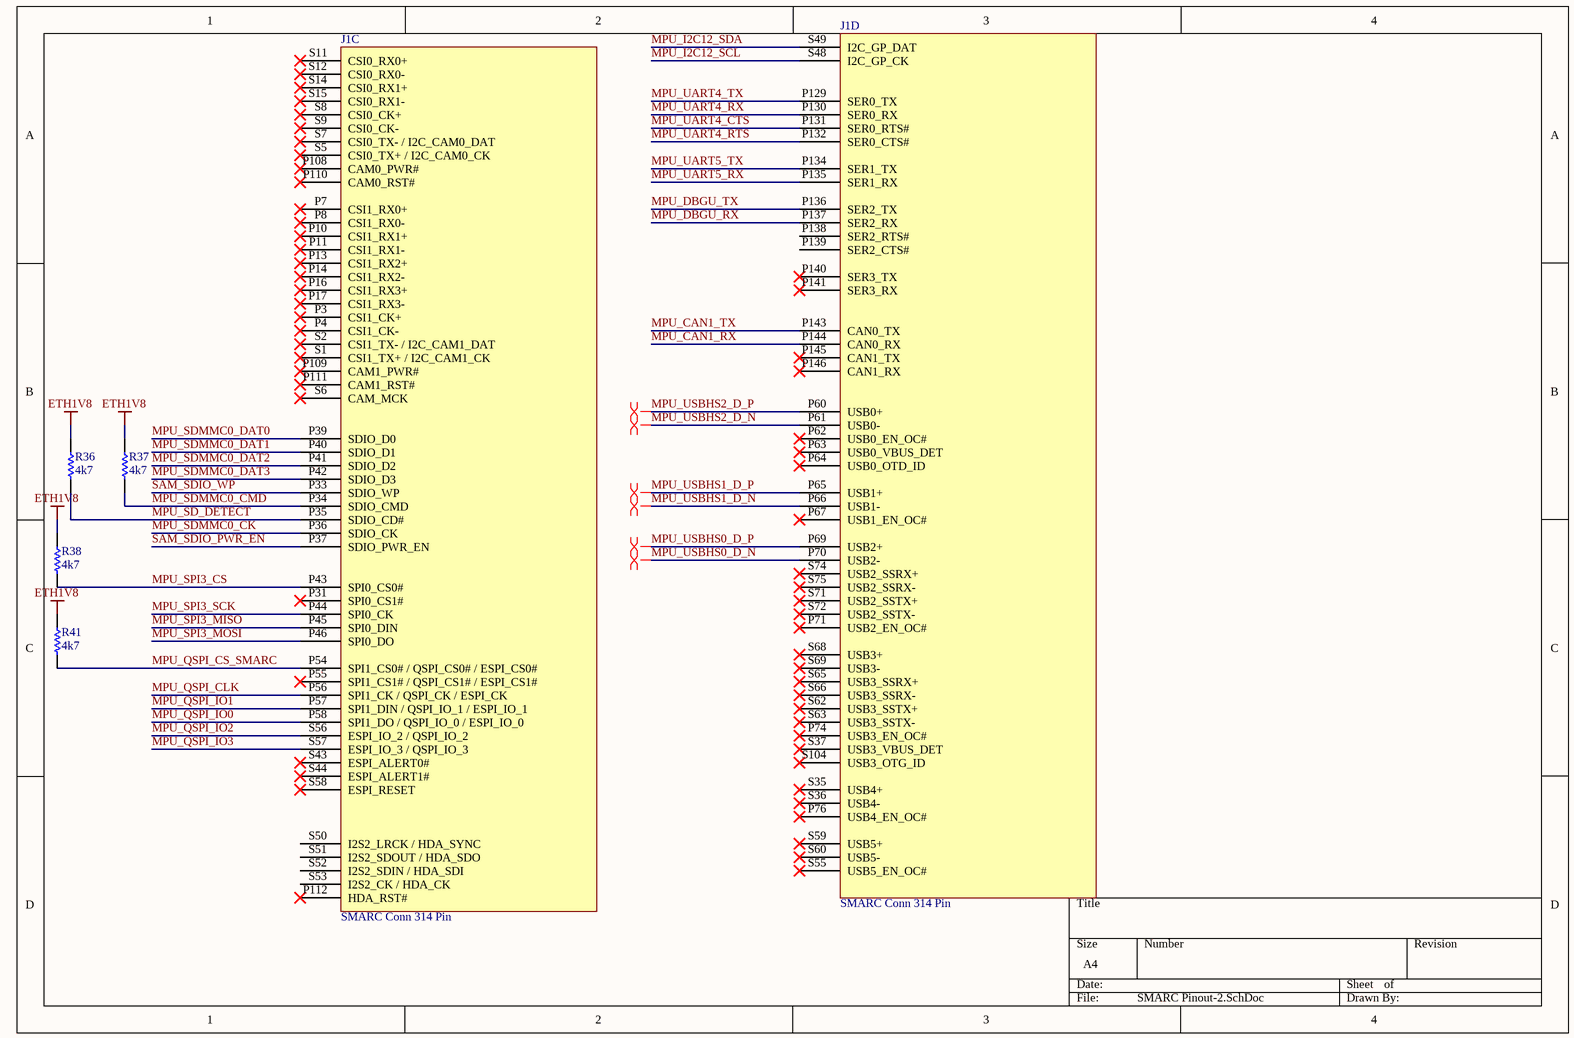
[diagram p5: SMARC Pinout-2.SchDoc]

### Parts
J1  SMARC Conn 314 Pin  [SMARC Conn 314 Pin]  (parts C,D of 6)
R36  4k7  [RES-0201]
R37  4k7  [RES-0201]
R38  4k7  [RES-0201]
R41  4k7  [RES-0201]

### Nets
ETH1V8: R36.2 R37.2 R38.2 R41.2
MPU_CAN1_RX: J1.P144(CAN0_RX)
MPU_CAN1_TX: J1.P143(CAN0_TX)
MPU_DBGU_RX: J1.P137(SER2_RX)
MPU_DBGU_TX: J1.P136(SER2_TX)
MPU_GPIO_PB15: J1.P110(CAM0_RST#)
MPU_GPIO_PC6: J1.P111(CAM1_RST#)
MPU_GPIO_PC7: J1.P112(HDA_RST#)
MPU_GPIO_PC10: J1.P108(CAM0_PWR#)
MPU_GPIO_PC11: J1.P109(CAM1_PWR#)
MPU_I2C12_SCL: J1.S48(I2C_GP_CK)
MPU_I2C12_SDA: J1.S49(I2C_GP_DAT)
MPU_QSPI_CLK: J1.P56(SPI1_CK_/_QSPI_CK_/_ESPI_CK)
MPU_QSPI_CS_SMARC: J1.P54(SPI1_CS0#_/_QSPI_CS0#_/_ESPI_CS0#) R41.1
MPU_QSPI_IO0: J1.P58(SPI1_DO_/_QSPI_IO_0_/_ESPI_IO_0)
MPU_QSPI_IO1: J1.P57(SPI1_DIN_/_QSPI_IO_1_/_ESPI_IO_1)
MPU_QSPI_IO2: J1.S56(ESPI_IO_2_/_QSPI_IO_2)
MPU_QSPI_IO3: J1.S57(ESPI_IO_3_/_QSPI_IO_3)
MPU_SD_DETECT: J1.P35(SDIO_CD#) R36.1
MPU_SDMMC0_CK: J1.P36(SDIO_CK)
MPU_SDMMC0_CMD: J1.P34(SDIO_CMD) R37.1
MPU_SDMMC0_DAT0: J1.P39(SDIO_D0)
MPU_SDMMC0_DAT1: J1.P40(SDIO_D1)
MPU_SDMMC0_DAT2: J1.P41(SDIO_D2)
MPU_SDMMC0_DAT3: J1.P42(SDIO_D3)
MPU_SPI3_CS: J1.P43(SPI0_CS0#) R38.1
MPU_SPI3_MISO: J1.P45(SPI0_DIN)
MPU_SPI3_MOSI: J1.P46(SPI0_DO)
MPU_SPI3_SCK: J1.P44(SPI0_CK)
MPU_UART4_CTS: J1.P131(SER0_RTS#)
MPU_UART4_RTS: J1.P132(SER0_CTS#)
MPU_UART4_RX: J1.P130(SER0_RX)
MPU_UART4_TX: J1.P129(SER0_TX)
MPU_UART5_RX: J1.P135(SER1_RX)
MPU_UART5_TX: J1.P134(SER1_TX)
MPU_USBHS0_D_N: J1.P70(USB2-)
MPU_USBHS0_D_P: J1.P69(USB2+)
MPU_USBHS1_D_N: J1.P66(USB1-)
MPU_USBHS1_D_P: J1.P65(USB1+)
MPU_USBHS2_D_N: J1.P61(USB0-)
MPU_USBHS2_D_P: J1.P60(USB0+)
SAM_SDIO_PWR_EN: J1.P37(SDIO_PWR_EN)
SAM_SDIO_WP: J1.P33(SDIO_WP)

Not connected (* = marked no-connect by the designer): J1 P3(CSI1_CK+)* P4(CSI1_CK-)* P7(CSI1_RX0+)* P8(CSI1_RX0-)* P10(CSI1_RX1+)* P11(CSI1_RX1-)* P13(CSI1_RX2+)* P14(CSI1_RX2-)* P16(CSI1_RX3+)* P17(CSI1_RX3-)* P31(SPI0_CS1#)* P55(SPI1_CS1#_/_QSPI_CS1#_/_ESPI_CS1#)* P62(USB0_EN_OC#)* P63(USB0_VBUS_DET)* P64(USB0_OTD_ID)* P67(USB1_EN_OC#)* P71(USB2_EN_OC#)* P74(USB3_EN_OC#)* P76(USB4_EN_OC#)* P138(SER2_RTS#) P139(SER2_CTS#) P140(SER3_TX)* P141(SER3_RX)* P145(CAN1_TX)* P146(CAN1_RX)* S1(CSI1_TX+_/_I2C_CAM1_CK)* S2(CSI1_TX-_/_I2C_CAM1_DAT)* S5(CSI0_TX+_/_I2C_CAM0_CK)* S6(CAM_MCK)* S7(CSI0_TX-_/_I2C_CAM0_DAT)* S8(CSI0_CK+)* S9(CSI0_CK-)* S11(CSI0_RX0+)* S12(CSI0_RX0-)* S14(CSI0_RX1+)* S15(CSI0_RX1-)* S35(USB4+)* S36(USB4-)* S37(USB3_VBUS_DET)* S43(ESPI_ALERT0#)* S44(ESPI_ALERT1#)* S50(I2S2_LRCK_/_HDA_SYNC) S51(I2S2_SDOUT_/_HDA_SDO) S52(I2S2_SDIN_/_HDA_SDI) S53(I2S2_CK_/_HDA_CK) S55(USB5_EN_OC#)* S58(ESPI_RESET)* S59(USB5+)* S60(USB5-)* S62(USB3_SSTX+)* S63(USB3_SSTX-)* S65(USB3_SSRX+)* S66(USB3_SSRX-)* S68(USB3+)* S69(USB3-)* S71(USB2_SSTX+)* S72(USB2_SSTX-)* S74(USB2_SSRX+)* S75(USB2_SSRX-)* S104(USB3_OTG_ID)*

### Layout directives
differential pair: MPU_USBHS0_D_N, MPU_USBHS0_D_P, MPU_USBHS1_D_N, MPU_USBHS1_D_P, MPU_USBHS2_D_N, MPU_USBHS2_D_P

### Library data of the parts
R36-R38 R41 = RES-0201: Resistor chip. 0201

## Sheet SMARC Pinout-3.SchDoc
size A4; SheetNumber: 7; SheetTotal: 10
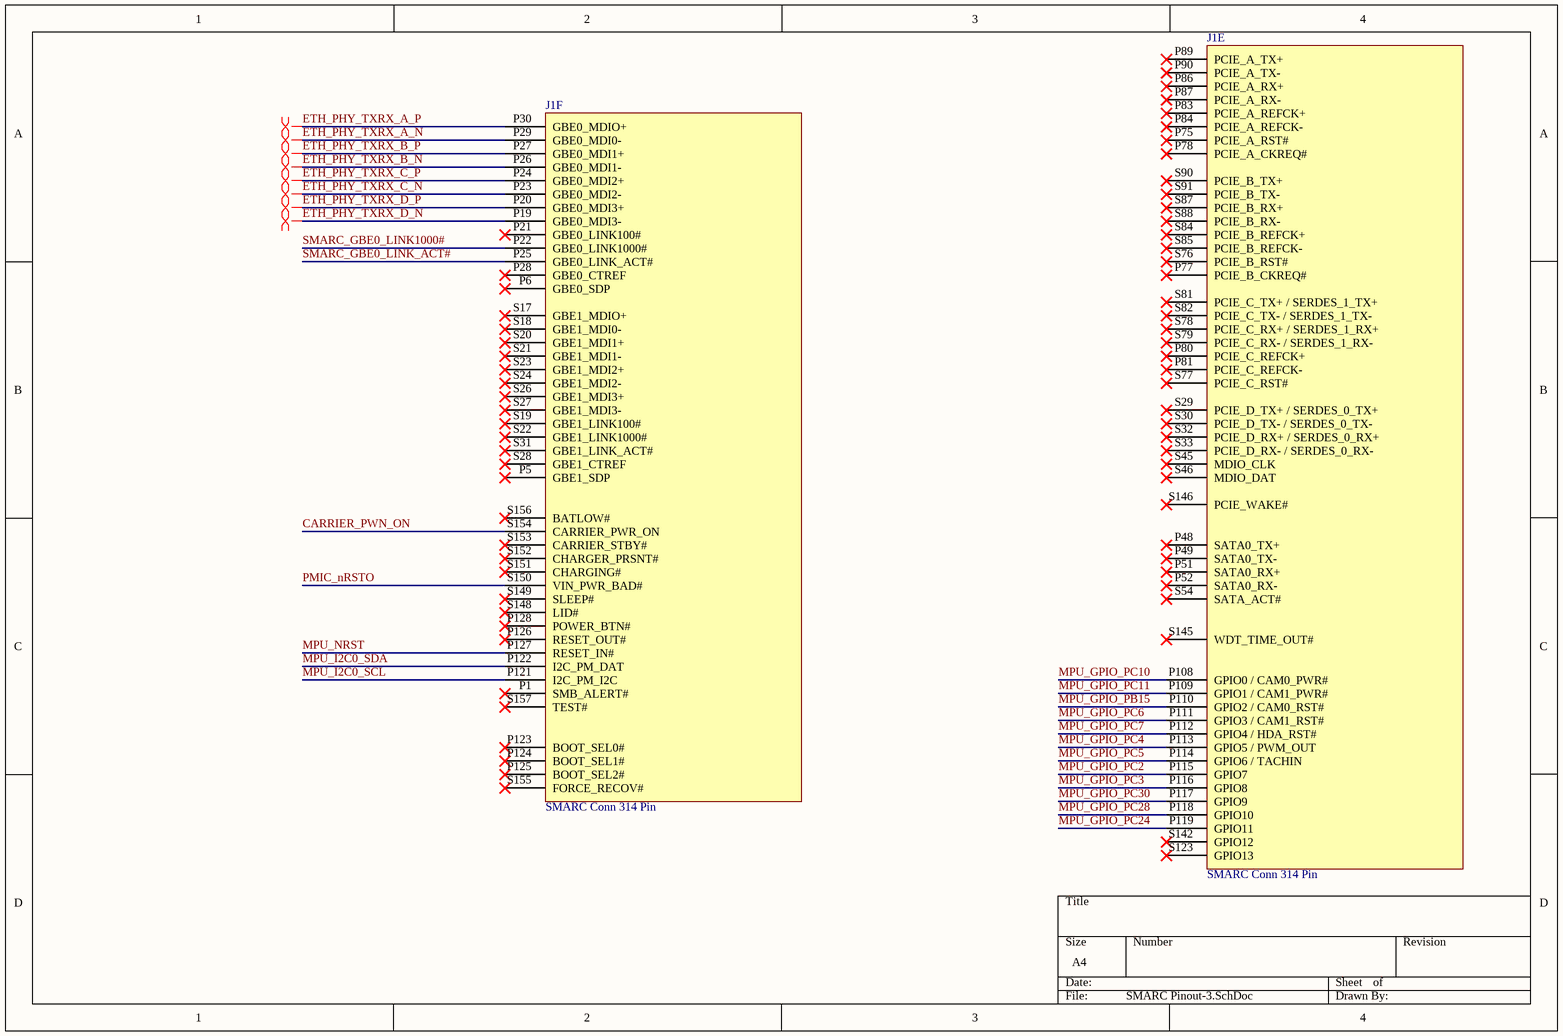
[diagram p6: SMARC Pinout-3.SchDoc]

### Parts
J1  SMARC Conn 314 Pin  [SMARC Conn 314 Pin]  (parts E,F of 6)

### Nets
CARRIER_PWN_ON: J1.S154(CARRIER_PWR_ON)
ETH_PHY_TXRX_A_N: J1.P29(GBE0_MDI0-)
ETH_PHY_TXRX_A_P: J1.P30(GBE0_MDIO+)
ETH_PHY_TXRX_B_N: J1.P26(GBE0_MDI1-)
ETH_PHY_TXRX_B_P: J1.P27(GBE0_MDI1+)
ETH_PHY_TXRX_C_N: J1.P23(GBE0_MDI2-)
ETH_PHY_TXRX_C_P: J1.P24(GBE0_MDI2+)
ETH_PHY_TXRX_D_N: J1.P19(GBE0_MDI3-)
ETH_PHY_TXRX_D_P: J1.P20(GBE0_MDI3+)
MPU_GPIO_PB15: J1.P110(GPIO2_/_CAM0_RST#)
MPU_GPIO_PC2: J1.P115(GPIO7)
MPU_GPIO_PC3: J1.P116(GPIO8)
MPU_GPIO_PC4: J1.P113(GPIO5_/_PWM_OUT)
MPU_GPIO_PC5: J1.P114(GPIO6_/_TACHIN)
MPU_GPIO_PC6: J1.P111(GPIO3_/_CAM1_RST#)
MPU_GPIO_PC7: J1.P112(GPIO4_/_HDA_RST#)
MPU_GPIO_PC10: J1.P108(GPIO0_/_CAM0_PWR#)
MPU_GPIO_PC11: J1.P109(GPIO1_/_CAM1_PWR#)
MPU_GPIO_PC24: J1.P119(GPIO11)
MPU_GPIO_PC28: J1.P118(GPIO10)
MPU_GPIO_PC30: J1.P117(GPIO9)
MPU_I2C0_SCL: J1.P121(I2C_PM_I2C)
MPU_I2C0_SDA: J1.P122(I2C_PM_DAT)
MPU_NRST: J1.P127(RESET_IN#)
PMIC_nRSTO: J1.S150(VIN_PWR_BAD#)
SMARC_GBE0_LINK1000#: J1.P22(GBE0_LINK1000#)
SMARC_GBE0_LINK_ACT#: J1.P25(GBE0_LINK_ACT#)

Not connected (* = marked no-connect by the designer): J1 P1(SMB_ALERT#)* P5(GBE1_SDP)* P6(GBE0_SDP)* P21(GBE0_LINK100#)* P28(GBE0_CTREF)* P48(SATA0_TX+)* P49(SATA0_TX-)* P51(SATA0_RX+)* P52(SATA0_RX-)* P75(PCIE_A_RST#)* P77(PCIE_B_CKREQ#)* P78(PCIE_A_CKREQ#)* P80(PCIE_C_REFCK+)* P81(PCIE_C_REFCK-)* P83(PCIE_A_REFCK+)* P84(PCIE_A_REFCK-)* P86(PCIE_A_RX+)* P87(PCIE_A_RX-)* P89(PCIE_A_TX+)* P90(PCIE_A_TX-)* P123(BOOT_SEL0#)* P124(BOOT_SEL1#)* P125(BOOT_SEL2#)* P126(RESET_OUT#)* P128(POWER_BTN#)* S17(GBE1_MDIO+)* S18(GBE1_MDI0-)* S19(GBE1_LINK100#)* S20(GBE1_MDI1+)* S21(GBE1_MDI1-)* S22(GBE1_LINK1000#)* S23(GBE1_MDI2+)* S24(GBE1_MDI2-)* S26(GBE1_MDI3+)* S27(GBE1_MDI3-)* S28(GBE1_CTREF)* S29(PCIE_D_TX+_/_SERDES_0_TX+)* S30(PCIE_D_TX-_/_SERDES_0_TX-)* S31(GBE1_LINK_ACT#)* S32(PCIE_D_RX+_/_SERDES_0_RX+)* S33(PCIE_D_RX-_/_SERDES_0_RX-)* S45(MDIO_CLK)* S46(MDIO_DAT)* S54(SATA_ACT#)* S76(PCIE_B_RST#)* S77(PCIE_C_RST#)* S78(PCIE_C_RX+_/_SERDES_1_RX+)* S79(PCIE_C_RX-_/_SERDES_1_RX-)* S81(PCIE_C_TX+_/_SERDES_1_TX+)* S82(PCIE_C_TX-_/_SERDES_1_TX-)* S84(PCIE_B_REFCK+)* S85(PCIE_B_REFCK-)* S87(PCIE_B_RX+)* S88(PCIE_B_RX-)* S90(PCIE_B_TX+)* S91(PCIE_B_TX-)* S123(GPIO13)* S142(GPIO12)* S145(WDT_TIME_OUT#)* S146(PCIE_WAKE#)* S148(LID#)* S149(SLEEP#)* S151(CHARGING#)* S152(CHARGER_PRSNT#)* S153(CARRIER_STBY#)* S155(FORCE_RECOV#)* S156(BATLOW#)* S157(TEST#)*

### Layout directives
differential pair: ETH_PHY_TXRX_A_N, ETH_PHY_TXRX_A_P, ETH_PHY_TXRX_B_N, ETH_PHY_TXRX_B_P, ETH_PHY_TXRX_C_N, ETH_PHY_TXRX_C_P, ETH_PHY_TXRX_D_N, ETH_PHY_TXRX_D_P

## Sheet Flash.SchDoc
size A4; SheetNumber: 8; SheetTotal: 10
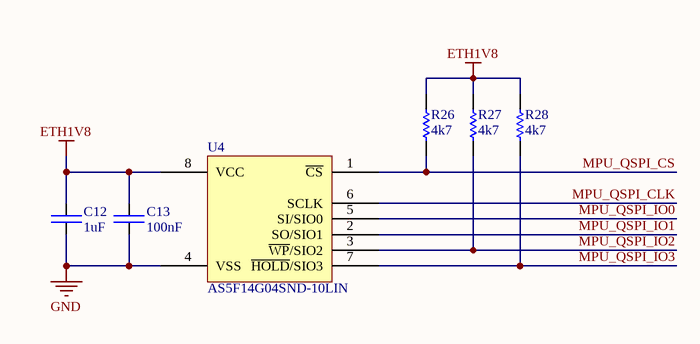
[diagram p7: Flash.SchDoc]

### Parts
C12  1uF  [CAP-0805]
C13  100nF  [CAP-0603]
R26  4k7  [RES-0603]
R27  4k7  [RES-0603]
R28  4k7  [RES-0603]
U4  AS5F14G04SND-10LIN  [AS5F34G04SNDA-08LIN]

### Nets
ETH1V8: C12.2 C13.2 R26.2 R27.2 R28.2 U4.8(VCC)
GND: C12.1 C13.1 U4.4(VSS)
MPU_QSPI_CLK: U4.6(SCLK)
MPU_QSPI_CS: R26.1 U4.1(~{CS})
MPU_QSPI_IO0: U4.5(SI/SIO0)
MPU_QSPI_IO1: U4.2(SO/SIO1)
MPU_QSPI_IO2: R27.1 U4.3(~{WP}/SIO2)
MPU_QSPI_IO3: R28.1 U4.7(~{HOLD}/SIO3)

### Library data of the parts
C12 = CAP-0805: Capacitor chip unpolarized. 0805
C13 = CAP-0603: Capacitor chip unpolarized. 0603
R26-R28 = RES-0603: Resistor chip. 0603
U4 = AS5F34G04SNDA-08LIN: FLASH SPI/QUAD 4GBIT

## Sheet Level Shifting.SchDoc
size A4; SheetNumber: 9; SheetTotal: 10
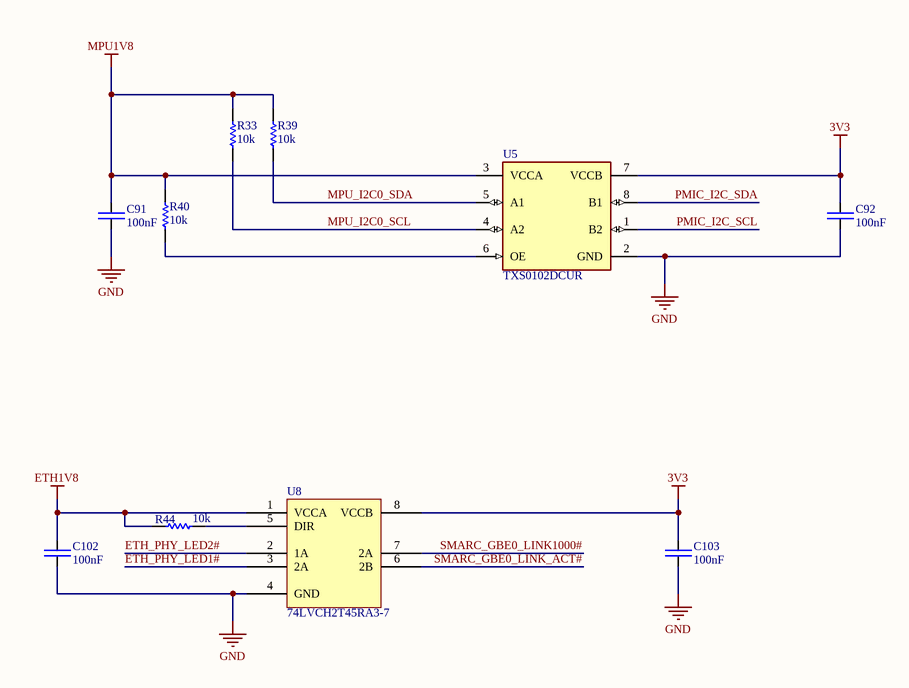
[diagram p8: Level Shifting.SchDoc]

### Parts
C91  100nF  [CAP-0603]
C92  100nF  [CAP-0603]
C102  100nF  [CAP-0201]
C103  100nF  [CAP-0201]
R33  10k  [RES-0603]
R39  10k  [RES-0603]
R40  10k  [RES-0603]
R44  10k  [RES-0201]
U5  TXS0102DCUR  [FP-DCU0008A-MFG]
U8  74LVCH2T45RA3-7  [74LVCH2T45RA3-7]

### Nets
3V3: C92.2 C103.2 U5.7(VCCB) U8.8(VCCB)
ETH1V8: C102.2 R44.1 U8.1(VCCA)
GND: C91.1 C92.1 C102.1 C103.1 U5.2(GND) U8.4(GND)
MPU1V8: C91.2 R33.2 R39.2 R40.2 U5.3(VCCA)
ETH_PHY_LED1#: U8.3(2A)
ETH_PHY_LED2#: U8.2(1A)
MPU_I2C0_SCL: R33.1 U5.4(A2)
MPU_I2C0_SDA: R39.1 U5.5(A1)
PMIC_I2C_SCL: U5.1(B2)
PMIC_I2C_SDA: U5.8(B1)
SMARC_GBE0_LINK1000#: U8.7(2A)
SMARC_GBE0_LINK_ACT#: U8.6(2B)
NetR40_1: R40.1 U5.6(OE)
NetR44_2: R44.2 U8.5(DIR)

### Library data of the parts
C91 C92 = CAP-0603: Capacitor chip unpolarized. 0603
C102 C103 = CAP-0201: Capacitor chip upolarized. 0201
R33 R39 R40 = RES-0603: Resistor chip. 0603
R44 = RES-0201: Resistor chip. 0201
U5 = CMP-0859-00001-2: IC TRNSLTR BIDIRECTIONAL US8; Manufacturer: Texas Instruments; Number Of Circuits: 1; Number Of Inputs: 2; Data Rate: 24Mbits/s; Max Junction Temp: +150°C; V A Min: 1.65V; Standoff Height: 0mm; Logic Function Desc: Bidirectional Voltage-Level Translator; Max Supply Voltage: 5.5V; V A Max: 3.6V; Nominal Supply Current: 1-14.4uA; V B Min: 2.3V; Temperature: -40°C to +85°C; Temperature Range Low: -40°C; Height: 0.9mm; Device Class L1: Integrated Circuits (ICs); RoHS: TRUE; Min Supply Voltage: 1.65V; Digikey Description: IC TRNSLTR BIDIRECTIONAL US8; ComponentLink2Description: Datasheet; Octopart: https://octopart.com/txs0102dcur-texas+instruments-5414308; Temperature Range High: +85°C; Device Class L2: Logic ICs; Category: IC; Ambient Temperature Range High: +85°C; Automotive: No; Manufacturer Part Number: TXS0102DCUR; Device Class L3: Voltage Level Shifters; Number Of Outputs: 2; Ambient Temperature Range Low: -40°C; Lead Free: Yes; ComponentLink2URL: http://www.ti.com/lit/ds/symlink/txs0102.pdf; V B Max: 5.5V; Package: DCU0008A; Mouser Description: Translation - Voltage Levels 2-Bit Bi-Directional Voltage-Level-Trans
U8 = 74LVCH2T45RA3-7: Level shifter dual input bidirectional

## Sheet LDO.SchDoc
size A4; SheetNumber: 11; SheetTotal: 11
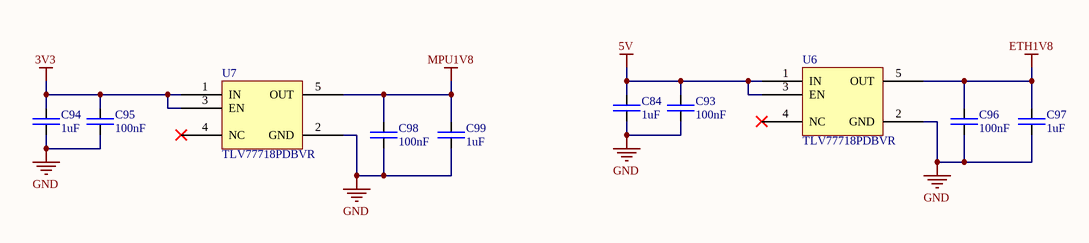
[diagram p9: LDO.SchDoc]

### Parts
C84  1uF  [CAP-0805]
C93  100nF  [CAP-0603]
C94  1uF  [CAP-0805]
C95  100nF  [CAP-0603]
C96  100nF  [CAP-0603]
C97  1uF  [CAP-0805]
C98  100nF  [CAP-0603]
C99  1uF  [CAP-0805]
U6  TLV77718PDBVR  [TLV77718PDBVR]
U7  TLV77718PDBVR  [TLV77718PDBVR]

### Nets
3V3: C94.2 C95.2 U7.1(IN) U7.3(EN)
5V: C84.2 C93.2 U6.1(IN) U6.3(EN)
ETH1V8: C96.2 C97.2 U6.5(OUT)
GND: C84.1 C93.1 C94.1 C95.1 C96.1 C97.1 C98.1 C99.1 U6.2(GND) U7.2(GND)
MPU1V8: C98.2 C99.2 U7.5(OUT)

Not connected (* = marked no-connect by the designer): U6 4(NC)*; U7 4(NC)*

### Library data of the parts
C84 C94 C97 C99 = CAP-0805: Capacitor chip unpolarized. 0805
C93 C95 C96 C98 = CAP-0603: Capacitor chip unpolarized. 0603
U6 U7 = TLV77718PDBVR: LDO 1.8V 1A

## Nets that join several sheets
3V3: SAM9X75 PWR (13 pins), PMIC (9 pins), Ethernet (C82.2 C83.2 U3.1 U3.12), Level Shifting (C92.2 C103.2 U5.7 U8.8), LDO (C94.2 C95.2 U7.1 U7.3)
5V: PMIC (14 pins), SMARC Pinout-1 (11 pins), LDO (C84.2 C93.2 U6.1 U6.3)
CORE1V15: SAM9X75 PWR (19 pins), PMIC (C7.1 L3.2 U1.25)
DDR1V35: SAM9X75 PWR (45 pins), SAM9X75 Pinout (R42.2), PMIC (C5.1 L2.2 U1.16)
ETH1V8: SAM9X75 Pinout (R31.2 R34.2), Ethernet (12 pins), SMARC Pinout-2 (R36.2 R37.2 R38.2 R41.2), Flash (6 pins), Level Shifting (C102.2 R44.1 U8.1), LDO (C96.2 C97.2 U6.5)
ETH1V15: PMIC (C9.1 L4.2 U1.32), Ethernet (18 pins)
GND: SAM9X75 PWR (128 pins), SAM9X75 Pinout (15 pins), PMIC (23 pins), Ethernet (26 pins), SMARC Pinout-1 (49 pins), Flash (C12.1 C13.1 U4.4), Level Shifting (6 pins), LDO (10 pins)
MPU1V8: SAM9X75 PWR (15 pins), SAM9X75 Pinout (C117.2 R35.2 U2.U3), Level Shifting (5 pins), LDO (C98.2 C99.2 U7.5)
CARRIER_PWN_ON: SAM9X75 Pinout (U2.T5), SMARC Pinout-3 (J1.S154)
ETH_NRST: SAM9X75 Pinout (U2.G17), Ethernet (R24.1 U3.42)
ETH_PHY_G125CK: SAM9X75 Pinout (U2.H16), Ethernet (R19.2)
ETH_PHY_LED1#: Ethernet (R17.1 U3.17), Level Shifting (U8.3)
ETH_PHY_LED2#: Ethernet (R16.1 U3.15), Level Shifting (U8.2)
ETH_PHY_TXRX_A_N: Ethernet (U3.3), SMARC Pinout-3 (J1.P29)
ETH_PHY_TXRX_A_P: Ethernet (U3.2), SMARC Pinout-3 (J1.P30)
ETH_PHY_TXRX_B_N: Ethernet (U3.6), SMARC Pinout-3 (J1.P26)
ETH_PHY_TXRX_B_P: Ethernet (U3.5), SMARC Pinout-3 (J1.P27)
ETH_PHY_TXRX_C_N: Ethernet (U3.8), SMARC Pinout-3 (J1.P23)
ETH_PHY_TXRX_C_P: Ethernet (U3.7), SMARC Pinout-3 (J1.P24)
ETH_PHY_TXRX_D_N: Ethernet (U3.11), SMARC Pinout-3 (J1.P19)
ETH_PHY_TXRX_D_P: Ethernet (U3.10), SMARC Pinout-3 (J1.P20)
LCD_BKLT_EN: SAM9X75 Pinout (U2.G2), SMARC Pinout-1 (J1.S127)
LCD_BKLT_PWM: SAM9X75 Pinout (U2.E2), SMARC Pinout-1 (J1.S141)
LCD_VDD_EN: SAM9X75 Pinout (U2.G1), SMARC Pinout-1 (J1.S133)
MPU_CAN1_RX: SAM9X75 Pinout (U2.L5), SMARC Pinout-2 (J1.P144)
MPU_CAN1_TX: SAM9X75 Pinout (U2.T4), SMARC Pinout-2 (J1.P143)
MPU_DBGU_RX: SAM9X75 Pinout (U2.N4), SMARC Pinout-2 (J1.P137)
MPU_DBGU_TX: SAM9X75 Pinout (U2.T1), SMARC Pinout-2 (J1.P136)
MPU_DSI_CLK_N: SAM9X75 Pinout (U2.K3), SMARC Pinout-1 (J1.S135)
MPU_DSI_CLK_P: SAM9X75 Pinout (U2.K4), SMARC Pinout-1 (J1.S134)
MPU_DSI_D0_N: SAM9X75 Pinout (U2.H1), SMARC Pinout-1 (J1.S126)
MPU_DSI_D0_P: SAM9X75 Pinout (U2.H2), SMARC Pinout-1 (J1.S125)
MPU_DSI_D1_N: SAM9X75 Pinout (U2.J1), SMARC Pinout-1 (J1.S129)
MPU_DSI_D1_P: SAM9X75 Pinout (U2.J2), SMARC Pinout-1 (J1.S128)
MPU_DSI_D2_N: SAM9X75 Pinout (U2.K1), SMARC Pinout-1 (J1.S132)
MPU_DSI_D2_P: SAM9X75 Pinout (U2.K2), SMARC Pinout-1 (J1.S131)
MPU_DSI_D3_N: SAM9X75 Pinout (U2.L3), SMARC Pinout-1 (J1.S138)
MPU_DSI_D3_P: SAM9X75 Pinout (U2.L4), SMARC Pinout-1 (J1.S137)
MPU_DSI_TE: SAM9X75 Pinout (U2.H3), SMARC Pinout-1 (J1.S144)
MPU_GMDC: SAM9X75 Pinout (U2.K16), Ethernet (U3.36)
MPU_GMDIO: SAM9X75 Pinout (U2.R14), Ethernet (U3.37)
MPU_GPIO_PB15: SAM9X75 Pinout (U2.C7), SMARC Pinout-2 (J1.P110), SMARC Pinout-3 (J1.P110)
MPU_GPIO_PC2: SAM9X75 Pinout (U2.A3), SMARC Pinout-3 (J1.P115)
MPU_GPIO_PC3: SAM9X75 Pinout (U2.B3), SMARC Pinout-3 (J1.P116)
MPU_GPIO_PC4: SAM9X75 Pinout (U2.A4), SMARC Pinout-3 (J1.P113)
MPU_GPIO_PC5: SAM9X75 Pinout (U2.B4), SMARC Pinout-3 (J1.P114)
MPU_GPIO_PC6: SAM9X75 Pinout (U2.A5), SMARC Pinout-2 (J1.P111), SMARC Pinout-3 (J1.P111)
MPU_GPIO_PC7: SAM9X75 Pinout (U2.B5), SMARC Pinout-2 (J1.P112), SMARC Pinout-3 (J1.P112)
MPU_GPIO_PC10: SAM9X75 Pinout (U2.A7), SMARC Pinout-2 (J1.P108), SMARC Pinout-3 (J1.P108)
MPU_GPIO_PC11: SAM9X75 Pinout (U2.B7), SMARC Pinout-2 (J1.P109), SMARC Pinout-3 (J1.P109)
MPU_GPIO_PC24: SAM9X75 Pinout (U2.C1), SMARC Pinout-3 (J1.P119)
MPU_GPIO_PC28: SAM9X75 Pinout (U2.B1), SMARC Pinout-3 (J1.P118)
MPU_GPIO_PC30: SAM9X75 Pinout (U2.A2), SMARC Pinout-3 (J1.P117)
MPU_GRX0: SAM9X75 Pinout (U2.T8), Ethernet (R20.2)
MPU_GRX1: SAM9X75 Pinout (U2.L16), Ethernet (R21.2)
MPU_GRX2: SAM9X75 Pinout (U2.G16), Ethernet (R22.2)
MPU_GRX3: SAM9X75 Pinout (U2.L15), Ethernet (R23.2)
MPU_GRXCK: SAM9X75 Pinout (U2.D17), Ethernet (R15.1 U3.35)
MPU_GRXCTL: SAM9X75 Pinout (U2.R8), Ethernet (R14.1 U3.33)
MPU_GTX0: SAM9X75 Pinout (U2.N16), Ethernet (U3.19)
MPU_GTX1: SAM9X75 Pinout (U2.E17), Ethernet (U3.20)
MPU_GTX2: SAM9X75 Pinout (U2.J16), Ethernet (U3.21)
MPU_GTX3: SAM9X75 Pinout (U2.N15), Ethernet (U3.22)
MPU_GTXCK: SAM9X75 Pinout (U2.F16), Ethernet (U3.24)
MPU_GTXCTL: SAM9X75 Pinout (U2.R13), Ethernet (U3.25)
MPU_I2C0_SCL: SAM9X75 Pinout (U2.R1), SMARC Pinout-3 (J1.P121), Level Shifting (R33.1 U5.4)
MPU_I2C0_SDA: SAM9X75 Pinout (U2.T3), SMARC Pinout-3 (J1.P122), Level Shifting (R39.1 U5.5)
MPU_I2C12_SCL: SAM9X75 Pinout (R34.1 U2.C10), SMARC Pinout-2 (J1.S48)
MPU_I2C12_SDA: SAM9X75 Pinout (R31.1 U2.A10), SMARC Pinout-2 (J1.S49)
MPU_NRST: SAM9X75 Pinout (5 pins), PMIC (U1.2), SMARC Pinout-3 (J1.P127)
MPU_QSPI_CLK: SAM9X75 Pinout (U2.A9), SMARC Pinout-2 (J1.P56), Flash (U4.6)
MPU_QSPI_CS: SAM9X75 Pinout (U2.B11), Flash (R26.1 U4.1)
MPU_QSPI_CS_SMARC: SAM9X75 Pinout (U2.A8), SMARC Pinout-2 (J1.P54 R41.1)
MPU_QSPI_IO0: SAM9X75 Pinout (U2.B9), SMARC Pinout-2 (J1.P58), Flash (U4.5)
MPU_QSPI_IO1: SAM9X75 Pinout (U2.D10), SMARC Pinout-2 (J1.P57), Flash (U4.2)
MPU_QSPI_IO2: SAM9X75 Pinout (U2.C8), SMARC Pinout-2 (J1.S56), Flash (R27.1 U4.3)
MPU_QSPI_IO3: SAM9X75 Pinout (U2.B10), SMARC Pinout-2 (J1.S57), Flash (R28.1 U4.7)
MPU_SD_DETECT: SAM9X75 Pinout (U2.L17), SMARC Pinout-2 (J1.P35 R36.1)
MPU_SDMMC0_CK: SAM9X75 Pinout (U2.K17), SMARC Pinout-2 (J1.P36)
MPU_SDMMC0_CMD: SAM9X75 Pinout (U2.T9), SMARC Pinout-2 (J1.P34 R37.1)
MPU_SDMMC0_DAT0: SAM9X75 Pinout (U2.H17), SMARC Pinout-2 (J1.P39)
MPU_SDMMC0_DAT1: SAM9X75 Pinout (U2.P16), SMARC Pinout-2 (J1.P40)
MPU_SDMMC0_DAT2: SAM9X75 Pinout (U2.J17), SMARC Pinout-2 (J1.P41)
MPU_SDMMC0_DAT3: SAM9X75 Pinout (U2.L13), SMARC Pinout-2 (J1.P42)
MPU_SPI3_CS: SAM9X75 Pinout (U2.C4), SMARC Pinout-2 (J1.P43 R38.1)
MPU_SPI3_MISO: SAM9X75 Pinout (U2.E4), SMARC Pinout-2 (J1.P45)
MPU_SPI3_MOSI: SAM9X75 Pinout (U2.D2), SMARC Pinout-2 (J1.P46)
MPU_SPI3_SCK: SAM9X75 Pinout (U2.C2), SMARC Pinout-2 (J1.P44)
MPU_UART4_CTS: SAM9X75 Pinout (U2.R5), SMARC Pinout-2 (J1.P131)
MPU_UART4_RTS: SAM9X75 Pinout (U2.U11), SMARC Pinout-2 (J1.P132)
MPU_UART4_RX: SAM9X75 Pinout (U2.T11), SMARC Pinout-2 (J1.P130)
MPU_UART4_TX: SAM9X75 Pinout (U2.M16), SMARC Pinout-2 (J1.P129)
MPU_UART5_RX: SAM9X75 Pinout (U2.T10), SMARC Pinout-2 (J1.P135)
MPU_UART5_TX: SAM9X75 Pinout (U2.U8), SMARC Pinout-2 (J1.P134)
MPU_USBHS0_D_N: SAM9X75 Pinout (U2.P2), SMARC Pinout-2 (J1.P70)
MPU_USBHS0_D_P: SAM9X75 Pinout (U2.P1), SMARC Pinout-2 (J1.P69)
MPU_USBHS1_D_N: SAM9X75 Pinout (U2.N2), SMARC Pinout-2 (J1.P66)
MPU_USBHS1_D_P: SAM9X75 Pinout (U2.N1), SMARC Pinout-2 (J1.P65)
MPU_USBHS2_D_N: SAM9X75 Pinout (U2.P3), SMARC Pinout-2 (J1.P61)
MPU_USBHS2_D_P: SAM9X75 Pinout (U2.N3), SMARC Pinout-2 (J1.P60)
MPU_WKUP: SAM9X75 Pinout (U2.T14), PMIC (R8.1 U1.7)
PMIC_I2C_SCL: PMIC (R4.1 U1.6), Level Shifting (U5.1)
PMIC_I2C_SDA: PMIC (R5.1 U1.5), Level Shifting (U5.8)
PMIC_nINTO: SAM9X75 Pinout (U2.P10), PMIC (R6.1 U1.1)
PMIC_PWRHLD: SAM9X75 Pinout (U2.U14), PMIC (R3.2 U1.8)
SAM_SDIO_PWR_EN: SAM9X75 Pinout (U2.A11), SMARC Pinout-2 (J1.P37)
SAM_SDIO_WP: SAM9X75 Pinout (U2.C11), SMARC Pinout-2 (J1.P33)
SMARC_GBE0_LINK1000#: SMARC Pinout-3 (J1.P22), Level Shifting (U8.7)
SMARC_GBE0_LINK_ACT#: SMARC Pinout-3 (J1.P25), Level Shifting (U8.6)